# EAGLE design Front 2016 (EAGLE 6.5.0)
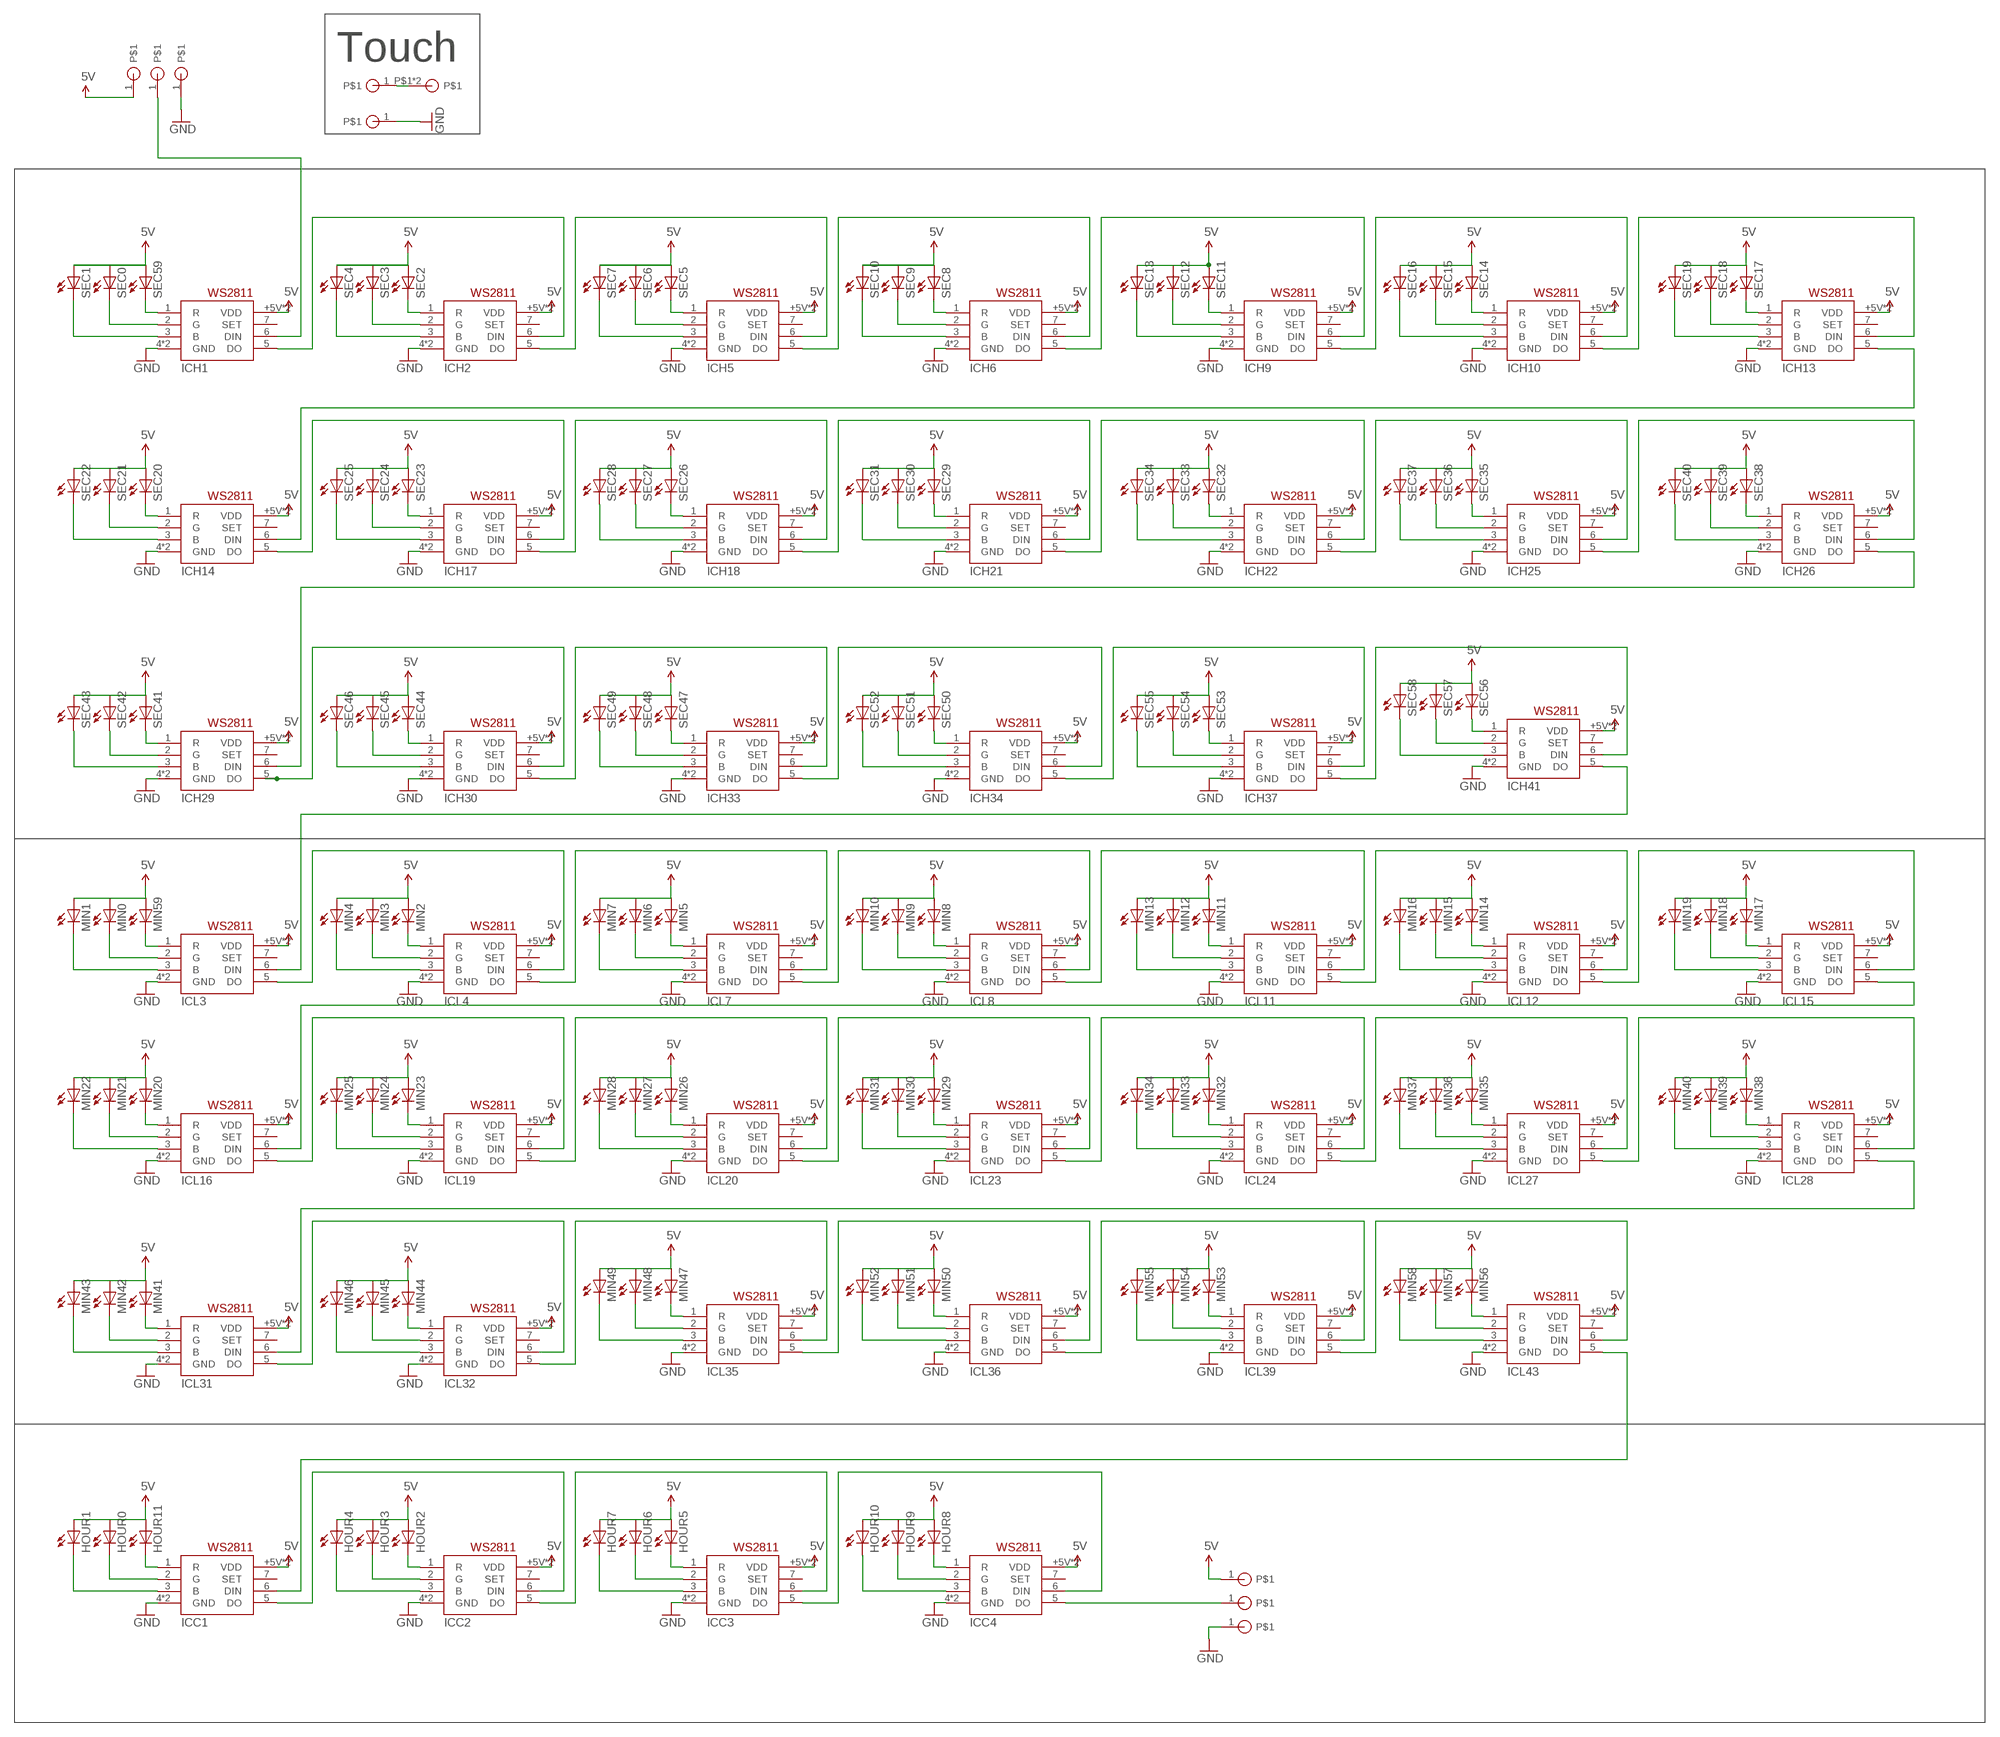
[diagram p0: schematic, sheet 1]

## Parts
+5V  SOLDER_PAD  [SOLDER_PAD]
+5V1  SOLDER_PAD  [SOLDER_PAD]
DIN  SOLDER_PAD  [SOLDER_PAD]
DOUT  SOLDER_PAD  [SOLDER_PAD]
GND  SOLDER_PAD  [SOLDER_PAD]
GND46  SOLDER_PAD  [SOLDER_PAD]
GND48  SOLDER_PAD  [SOLDER_PAD]
HOUR0  LEDCHIPLED_0603  [CHIPLED_0603]
HOUR1  LEDCHIPLED_0603  [CHIPLED_0603]
HOUR2  LEDCHIPLED_0603  [CHIPLED_0603]
HOUR3  LEDCHIPLED_0603  [CHIPLED_0603]
HOUR4  LEDCHIPLED_0603  [CHIPLED_0603]
HOUR5  LEDCHIPLED_0603  [CHIPLED_0603]
HOUR6  LEDCHIPLED_0603  [CHIPLED_0603]
HOUR7  LEDCHIPLED_0603  [CHIPLED_0603]
HOUR8  LEDCHIPLED_0603  [CHIPLED_0603]
HOUR9  LEDCHIPLED_0603  [CHIPLED_0603]
HOUR10  LEDCHIPLED_0603  [CHIPLED_0603]
HOUR11  LEDCHIPLED_0603  [CHIPLED_0603]
ICC1  WS2811-SOP8  [SO08-SKINNYPADS]
ICC2  WS2811-SOP8  [SO08-SKINNYPADS]
ICC3  WS2811-SOP8  [SO08-SKINNYPADS]
ICC4  WS2811-SOP8  [SO08-SKINNYPADS]
ICH1  WS2811-SOP8  [SO08-SKINNYPADS]
ICH2  WS2811-SOP8  [SO08-SKINNYPADS]
ICH5  WS2811-SOP8  [SO08-SKINNYPADS]
ICH6  WS2811-SOP8  [SO08-SKINNYPADS]
ICH9  WS2811-SOP8  [SO08-SKINNYPADS]
ICH10  WS2811-SOP8  [SO08-SKINNYPADS]
ICH13  WS2811-SOP8  [SO08-SKINNYPADS]
ICH14  WS2811-SOP8  [SO08-SKINNYPADS]
ICH17  WS2811-SOP8  [SO08-SKINNYPADS]
ICH18  WS2811-SOP8  [SO08-SKINNYPADS]
ICH21  WS2811-SOP8  [SO08-SKINNYPADS]
ICH22  WS2811-SOP8  [SO08-SKINNYPADS]
ICH25  WS2811-SOP8  [SO08-SKINNYPADS]
ICH26  WS2811-SOP8  [SO08-SKINNYPADS]
ICH29  WS2811-SOP8  [SO08-SKINNYPADS]
ICH30  WS2811-SOP8  [SO08-SKINNYPADS]
ICH33  WS2811-SOP8  [SO08-SKINNYPADS]
ICH34  WS2811-SOP8  [SO08-SKINNYPADS]
ICH37  WS2811-SOP8  [SO08-SKINNYPADS]
ICH41  WS2811-SOP8  [SO08-SKINNYPADS]
ICL3  WS2811-SOP8  [SO08-SKINNYPADS]
ICL4  WS2811-SOP8  [SO08-SKINNYPADS]
ICL7  WS2811-SOP8  [SO08-SKINNYPADS]
ICL8  WS2811-SOP8  [SO08-SKINNYPADS]
ICL11  WS2811-SOP8  [SO08-SKINNYPADS]
ICL12  WS2811-SOP8  [SO08-SKINNYPADS]
ICL15  WS2811-SOP8  [SO08-SKINNYPADS]
ICL16  WS2811-SOP8  [SO08-SKINNYPADS]
ICL19  WS2811-SOP8  [SO08-SKINNYPADS]
ICL20  WS2811-SOP8  [SO08-SKINNYPADS]
ICL23  WS2811-SOP8  [SO08-SKINNYPADS]
ICL24  WS2811-SOP8  [SO08-SKINNYPADS]
ICL27  WS2811-SOP8  [SO08-SKINNYPADS]
ICL28  WS2811-SOP8  [SO08-SKINNYPADS]
ICL31  WS2811-SOP8  [SO08-SKINNYPADS]
ICL32  WS2811-SOP8  [SO08-SKINNYPADS]
ICL35  WS2811-SOP8  [SO08-SKINNYPADS]
ICL36  WS2811-SOP8  [SO08-SKINNYPADS]
ICL39  WS2811-SOP8  [SO08-SKINNYPADS]
ICL43  WS2811-SOP8  [SO08-SKINNYPADS]
MIN0  LEDCHIPLED_0603  [CHIPLED_0603]
MIN1  LEDCHIPLED_0603  [CHIPLED_0603]
MIN2  LEDCHIPLED_0603  [CHIPLED_0603]
MIN3  LEDCHIPLED_0603  [CHIPLED_0603]
MIN4  LEDCHIPLED_0603  [CHIPLED_0603]
MIN5  LEDCHIPLED_0603  [CHIPLED_0603]
MIN6  LEDCHIPLED_0603  [CHIPLED_0603]
MIN7  LEDCHIPLED_0603  [CHIPLED_0603]
MIN8  LEDCHIPLED_0603  [CHIPLED_0603]
MIN9  LEDCHIPLED_0603  [CHIPLED_0603]
MIN10  LEDCHIPLED_0603  [CHIPLED_0603]
MIN11  LEDCHIPLED_0603  [CHIPLED_0603]
MIN12  LEDCHIPLED_0603  [CHIPLED_0603]
MIN13  LEDCHIPLED_0603  [CHIPLED_0603]
MIN14  LEDCHIPLED_0603  [CHIPLED_0603]
MIN15  LEDCHIPLED_0603  [CHIPLED_0603]
MIN16  LEDCHIPLED_0603  [CHIPLED_0603]
MIN17  LEDCHIPLED_0603  [CHIPLED_0603]
MIN18  LEDCHIPLED_0603  [CHIPLED_0603]
MIN19  LEDCHIPLED_0603  [CHIPLED_0603]
MIN20  LEDCHIPLED_0603  [CHIPLED_0603]
MIN21  LEDCHIPLED_0603  [CHIPLED_0603]
MIN22  LEDCHIPLED_0603  [CHIPLED_0603]
MIN23  LEDCHIPLED_0603  [CHIPLED_0603]
MIN24  LEDCHIPLED_0603  [CHIPLED_0603]
MIN25  LEDCHIPLED_0603  [CHIPLED_0603]
MIN26  LEDCHIPLED_0603  [CHIPLED_0603]
MIN27  LEDCHIPLED_0603  [CHIPLED_0603]
MIN28  LEDCHIPLED_0603  [CHIPLED_0603]
MIN29  LEDCHIPLED_0603  [CHIPLED_0603]
MIN30  LEDCHIPLED_0603  [CHIPLED_0603]
MIN31  LEDCHIPLED_0603  [CHIPLED_0603]
MIN32  LEDCHIPLED_0603  [CHIPLED_0603]
MIN33  LEDCHIPLED_0603  [CHIPLED_0603]
MIN34  LEDCHIPLED_0603  [CHIPLED_0603]
MIN35  LEDCHIPLED_0603  [CHIPLED_0603]
MIN36  LEDCHIPLED_0603  [CHIPLED_0603]
MIN37  LEDCHIPLED_0603  [CHIPLED_0603]
MIN38  LEDCHIPLED_0603  [CHIPLED_0603]
MIN39  LEDCHIPLED_0603  [CHIPLED_0603]
MIN40  LEDCHIPLED_0603  [CHIPLED_0603]
MIN41  LEDCHIPLED_0603  [CHIPLED_0603]
MIN42  LEDCHIPLED_0603  [CHIPLED_0603]
MIN43  LEDCHIPLED_0603  [CHIPLED_0603]
MIN44  LEDCHIPLED_0603  [CHIPLED_0603]
MIN45  LEDCHIPLED_0603  [CHIPLED_0603]
MIN46  LEDCHIPLED_0603  [CHIPLED_0603]
MIN47  LEDCHIPLED_0603  [CHIPLED_0603]
MIN48  LEDCHIPLED_0603  [CHIPLED_0603]
MIN49  LEDCHIPLED_0603  [CHIPLED_0603]
MIN50  LEDCHIPLED_0603  [CHIPLED_0603]
MIN51  LEDCHIPLED_0603  [CHIPLED_0603]
MIN52  LEDCHIPLED_0603  [CHIPLED_0603]
MIN53  LEDCHIPLED_0603  [CHIPLED_0603]
MIN54  LEDCHIPLED_0603  [CHIPLED_0603]
MIN55  LEDCHIPLED_0603  [CHIPLED_0603]
MIN56  LEDCHIPLED_0603  [CHIPLED_0603]
MIN57  LEDCHIPLED_0603  [CHIPLED_0603]
MIN58  LEDCHIPLED_0603  [CHIPLED_0603]
MIN59  LEDCHIPLED_0603  [CHIPLED_0603]
SEC0  LEDCHIPLED_0603  [CHIPLED_0603]
SEC1  LEDCHIPLED_0603  [CHIPLED_0603]
SEC2  LEDCHIPLED_0603  [CHIPLED_0603]
SEC3  LEDCHIPLED_0603  [CHIPLED_0603]
SEC4  LEDCHIPLED_0603  [CHIPLED_0603]
SEC5  LEDCHIPLED_0603  [CHIPLED_0603]
SEC6  LEDCHIPLED_0603  [CHIPLED_0603]
SEC7  LEDCHIPLED_0603  [CHIPLED_0603]
SEC8  LEDCHIPLED_0603  [CHIPLED_0603]
SEC9  LEDCHIPLED_0603  [CHIPLED_0603]
SEC10  LEDCHIPLED_0603  [CHIPLED_0603]
SEC11  LEDCHIPLED_0603  [CHIPLED_0603]
SEC12  LEDCHIPLED_0603  [CHIPLED_0603]
SEC13  LEDCHIPLED_0603  [CHIPLED_0603]
SEC14  LEDCHIPLED_0603  [CHIPLED_0603]
SEC15  LEDCHIPLED_0603  [CHIPLED_0603]
SEC16  LEDCHIPLED_0603  [CHIPLED_0603]
SEC17  LEDCHIPLED_0603  [CHIPLED_0603]
SEC18  LEDCHIPLED_0603  [CHIPLED_0603]
SEC19  LEDCHIPLED_0603  [CHIPLED_0603]
SEC20  LEDCHIPLED_0603  [CHIPLED_0603]
SEC21  LEDCHIPLED_0603  [CHIPLED_0603]
SEC22  LEDCHIPLED_0603  [CHIPLED_0603]
SEC23  LEDCHIPLED_0603  [CHIPLED_0603]
SEC24  LEDCHIPLED_0603  [CHIPLED_0603]
SEC25  LEDCHIPLED_0603  [CHIPLED_0603]
SEC26  LEDCHIPLED_0603  [CHIPLED_0603]
SEC27  LEDCHIPLED_0603  [CHIPLED_0603]
SEC28  LEDCHIPLED_0603  [CHIPLED_0603]
SEC29  LEDCHIPLED_0603  [CHIPLED_0603]
SEC30  LEDCHIPLED_0603  [CHIPLED_0603]
SEC31  LEDCHIPLED_0603  [CHIPLED_0603]
SEC32  LEDCHIPLED_0603  [CHIPLED_0603]
SEC33  LEDCHIPLED_0603  [CHIPLED_0603]
SEC34  LEDCHIPLED_0603  [CHIPLED_0603]
SEC35  LEDCHIPLED_0603  [CHIPLED_0603]
SEC36  LEDCHIPLED_0603  [CHIPLED_0603]
SEC37  LEDCHIPLED_0603  [CHIPLED_0603]
SEC38  LEDCHIPLED_0603  [CHIPLED_0603]
SEC39  LEDCHIPLED_0603  [CHIPLED_0603]
SEC40  LEDCHIPLED_0603  [CHIPLED_0603]
SEC41  LEDCHIPLED_0603  [CHIPLED_0603]
SEC42  LEDCHIPLED_0603  [CHIPLED_0603]
SEC43  LEDCHIPLED_0603  [CHIPLED_0603]
SEC44  LEDCHIPLED_0603  [CHIPLED_0603]
SEC45  LEDCHIPLED_0603  [CHIPLED_0603]
SEC46  LEDCHIPLED_0603  [CHIPLED_0603]
SEC47  LEDCHIPLED_0603  [CHIPLED_0603]
SEC48  LEDCHIPLED_0603  [CHIPLED_0603]
SEC49  LEDCHIPLED_0603  [CHIPLED_0603]
SEC50  LEDCHIPLED_0603  [CHIPLED_0603]
SEC51  LEDCHIPLED_0603  [CHIPLED_0603]
SEC52  LEDCHIPLED_0603  [CHIPLED_0603]
SEC53  LEDCHIPLED_0603  [CHIPLED_0603]
SEC54  LEDCHIPLED_0603  [CHIPLED_0603]
SEC55  LEDCHIPLED_0603  [CHIPLED_0603]
SEC56  LEDCHIPLED_0603  [CHIPLED_0603]
SEC57  LEDCHIPLED_0603  [CHIPLED_0603]
SEC58  LEDCHIPLED_0603  [CHIPLED_0603]
SEC59  LEDCHIPLED_0603  [CHIPLED_0603]
TOUCH  SOLDER_PAD  [SOLDER_PAD]
U$2  TOUCH_PAD_LARGE  [TOUCH_PAD_LARGE]

## Nets
5V: +5V1.1 +5V.1 HOUR0.A HOUR1.A HOUR2.A HOUR3.A HOUR4.A HOUR5.A HOUR6.A HOUR7.A HOUR8.A HOUR9.A HOUR10.A HOUR11.A ICC1.8(VDD) ICC1.+5V(VDD) ICC2.8(VDD) ICC2.+5V(VDD) ICC3.8(VDD) ICC3.+5V(VDD) ICC4.8(VDD) ICC4.+5V(VDD) ICH1.8(VDD) ICH1.+5V(VDD) ICH2.8(VDD) ICH2.+5V(VDD) ICH5.8(VDD) ICH5.+5V(VDD) ICH6.8(VDD) ICH6.+5V(VDD) ICH9.8(VDD) ICH9.+5V(VDD) ICH10.8(VDD) ICH10.+5V(VDD) ICH13.8(VDD) ICH13.+5V(VDD) ICH14.8(VDD) ICH14.+5V(VDD) ICH17.8(VDD) ICH17.+5V(VDD) ICH18.8(VDD) ICH18.+5V(VDD) ICH21.8(VDD) ICH21.+5V(VDD) ICH22.8(VDD) ICH22.+5V(VDD) ICH25.8(VDD) ICH25.+5V(VDD) ICH26.8(VDD) ICH26.+5V(VDD) ICH29.8(VDD) ICH29.+5V(VDD) ICH30.8(VDD) ICH30.+5V(VDD) ICH33.8(VDD) ICH33.+5V(VDD) ICH34.8(VDD) ICH34.+5V(VDD) ICH37.8(VDD) ICH37.+5V(VDD) ICH41.8(VDD) ICH41.+5V(VDD) ICL3.8(VDD) ICL3.+5V(VDD) ICL4.8(VDD) ICL4.+5V(VDD) ICL7.8(VDD) ICL7.+5V(VDD) ICL8.8(VDD) ICL8.+5V(VDD) ICL11.8(VDD) ICL11.+5V(VDD) ICL12.8(VDD) ICL12.+5V(VDD) ICL15.8(VDD) ICL15.+5V(VDD) ICL16.8(VDD) ICL16.+5V(VDD) ICL19.8(VDD) ICL19.+5V(VDD) ICL20.8(VDD) ICL20.+5V(VDD) ICL23.8(VDD) ICL23.+5V(VDD) ICL24.8(VDD) ICL24.+5V(VDD) ICL27.8(VDD) ICL27.+5V(VDD) ICL28.8(VDD) ICL28.+5V(VDD) ICL31.8(VDD) ICL31.+5V(VDD) ICL32.8(VDD) ICL32.+5V(VDD) ICL35.8(VDD) ICL35.+5V(VDD) ICL36.8(VDD) ICL36.+5V(VDD) ICL39.8(VDD) ICL39.+5V(VDD) ICL43.8(VDD) ICL43.+5V(VDD) MIN0.A MIN1.A MIN2.A MIN3.A MIN4.A MIN5.A MIN6.A MIN7.A MIN8.A MIN9.A MIN10.A MIN11.A MIN12.A MIN13.A MIN14.A MIN15.A MIN16.A MIN17.A MIN18.A MIN19.A MIN20.A MIN21.A MIN22.A MIN23.A MIN24.A MIN25.A MIN26.A MIN27.A MIN28.A MIN29.A MIN30.A MIN31.A MIN32.A MIN33.A MIN34.A MIN35.A MIN36.A MIN37.A MIN38.A MIN39.A MIN40.A MIN41.A MIN42.A MIN43.A MIN44.A MIN45.A MIN46.A MIN47.A MIN48.A MIN49.A MIN50.A MIN51.A MIN52.A MIN53.A MIN54.A MIN55.A MIN56.A MIN57.A MIN58.A MIN59.A SEC0.A SEC1.A SEC2.A SEC3.A SEC4.A SEC5.A SEC6.A SEC7.A SEC8.A SEC9.A SEC10.A SEC11.A SEC12.A SEC13.A SEC14.A SEC15.A SEC16.A SEC17.A SEC18.A SEC19.A SEC20.A SEC21.A SEC22.A SEC23.A SEC24.A SEC25.A SEC26.A SEC27.A SEC28.A SEC29.A SEC30.A SEC31.A SEC32.A SEC33.A SEC34.A SEC35.A SEC36.A SEC37.A SEC38.A SEC39.A SEC40.A SEC41.A SEC42.A SEC43.A SEC44.A SEC45.A SEC46.A SEC47.A SEC48.A SEC49.A SEC50.A SEC51.A SEC52.A SEC53.A SEC54.A SEC55.A SEC56.A SEC57.A SEC58.A SEC59.A
GND: GND46.1 GND48.1 GND.1 ICC1.4(GND) ICC1.GND ICC2.4(GND) ICC2.GND ICC3.4(GND) ICC3.GND ICC4.4(GND) ICC4.GND ICH1.4(GND) ICH1.GND ICH2.4(GND) ICH2.GND ICH5.4(GND) ICH5.GND ICH6.4(GND) ICH6.GND ICH9.4(GND) ICH9.GND ICH10.4(GND) ICH10.GND ICH13.4(GND) ICH13.GND ICH14.4(GND) ICH14.GND ICH17.4(GND) ICH17.GND ICH18.4(GND) ICH18.GND ICH21.4(GND) ICH21.GND ICH22.4(GND) ICH22.GND ICH25.4(GND) ICH25.GND ICH26.4(GND) ICH26.GND ICH29.4(GND) ICH29.GND ICH30.4(GND) ICH30.GND ICH33.4(GND) ICH33.GND ICH34.4(GND) ICH34.GND ICH37.4(GND) ICH37.GND ICH41.4(GND) ICH41.GND ICL3.4(GND) ICL3.GND ICL4.4(GND) ICL4.GND ICL7.4(GND) ICL7.GND ICL8.4(GND) ICL8.GND ICL11.4(GND) ICL11.GND ICL12.4(GND) ICL12.GND ICL15.4(GND) ICL15.GND ICL16.4(GND) ICL16.GND ICL19.4(GND) ICL19.GND ICL20.4(GND) ICL20.GND ICL23.4(GND) ICL23.GND ICL24.4(GND) ICL24.GND ICL27.4(GND) ICL27.GND ICL28.4(GND) ICL28.GND ICL31.4(GND) ICL31.GND ICL32.4(GND) ICL32.GND ICL35.4(GND) ICL35.GND ICL36.4(GND) ICL36.GND ICL39.4(GND) ICL39.GND ICL43.4(GND) ICL43.GND
N$1: ICH1.1(R) SEC59.C
N$2: ICH1.3(B) SEC1.C
N$3: ICH1.2(G) SEC0.C
N$4: ICH2.1(R) SEC2.C
N$5: ICH2.2(G) SEC3.C
N$6: ICH2.3(B) SEC4.C
N$7: ICH5.1(R) SEC5.C
N$8: ICH5.2(G) SEC6.C
N$9: ICH5.3(B) SEC7.C
N$10: ICH6.1(R) SEC8.C
N$11: ICH6.2(G) SEC9.C
N$12: ICH6.3(B) SEC10.C
N$13: ICH13.1(R) SEC17.C
N$14: ICH9.1(R) SEC11.C
N$15: ICH9.2(G) SEC12.C
N$16: ICH9.3(B) SEC13.C
N$17: ICH26.2(G) SEC39.C
N$18: ICH10.1(R) SEC14.C
N$19: ICH10.2(G) SEC15.C
N$20: ICH10.3(B) SEC16.C
N$21: ICH14.1(R) SEC20.C
N$22: ICH13.2(G) SEC18.C
N$23: ICH13.3(B) SEC19.C
N$24: ICH14.2(G) SEC21.C
N$25: ICH14.3(B) SEC22.C
N$26: ICH26.3(B) SEC40.C
N$27: ICH17.1(R) SEC23.C
N$28: ICH17.2(G) SEC24.C
N$29: ICH17.3(B) SEC25.C
N$30: ICH18.1(R) SEC26.C
N$31: ICH18.2(G) SEC27.C
N$32: ICH18.3(B) SEC28.C
N$33: ICH29.5(DO) ICH30.6(DIN)
N$34: ICH29.1(R) SEC41.C
N$35: ICH21.1(R) SEC29.C
N$36: ICH21.2(G) SEC30.C
N$37: ICH21.3(B) SEC31.C
N$38: ICH29.2(G) SEC42.C
N$39: ICH22.1(R) SEC32.C
N$40: ICH22.2(G) SEC33.C
N$41: ICH22.3(B) SEC34.C
N$42: ICH29.3(B) SEC43.C
N$43: ICH25.1(R) SEC35.C
N$44: ICH25.2(G) SEC36.C
N$45: ICH25.3(B) SEC37.C
N$46: ICH30.5(DO) ICH33.6(DIN)
N$47: ICH26.1(R) SEC38.C
N$48: ICH30.1(R) SEC44.C
N$49: ICH30.2(G) SEC45.C
N$50: ICH30.3(B) SEC46.C
N$51: ICH33.5(DO) ICH34.6(DIN)
N$52: ICH33.1(R) SEC47.C
N$53: ICH33.2(G) SEC48.C
N$54: ICH33.3(B) SEC49.C
N$55: ICH34.5(DO) ICH37.6(DIN)
N$56: ICH34.1(R) SEC50.C
N$57: ICH34.2(G) SEC51.C
N$58: ICH34.3(B) SEC52.C
N$59: ICH37.5(DO) ICH41.6(DIN)
N$60: ICH37.1(R) SEC53.C
N$61: ICH37.2(G) SEC54.C
N$62: ICH37.3(B) SEC55.C
N$63: ICH41.5(DO) ICL3.6(DIN)
N$64: ICH41.1(R) SEC56.C
N$65: ICH41.2(G) SEC57.C
N$66: ICH41.3(B) SEC58.C
N$67: ICH1.5(DO) ICH2.6(DIN)
N$68: ICH2.5(DO) ICH5.6(DIN)
N$69: ICH5.5(DO) ICH6.6(DIN)
N$70: ICH6.5(DO) ICH9.6(DIN)
N$71: ICH9.5(DO) ICH10.6(DIN)
N$72: ICH10.5(DO) ICH13.6(DIN)
N$73: ICH13.5(DO) ICH14.6(DIN)
N$74: ICH14.5(DO) ICH17.6(DIN)
N$75: ICH17.5(DO) ICH18.6(DIN)
N$76: ICH18.5(DO) ICH21.6(DIN)
N$77: ICH21.5(DO) ICH22.6(DIN)
N$78: ICH22.5(DO) ICH25.6(DIN)
N$79: ICH25.5(DO) ICH26.6(DIN)
N$80: ICH26.5(DO) ICH29.6(DIN)
N$81: ICL3.1(R) MIN59.C
N$82: ICL3.2(G) MIN0.C
N$83: ICL3.3(B) MIN1.C
N$84: ICL4.1(R) MIN2.C
N$85: ICL4.2(G) MIN3.C
N$86: ICL4.3(B) MIN4.C
N$87: ICL7.1(R) MIN5.C
N$88: ICL7.2(G) MIN6.C
N$89: ICL7.3(B) MIN7.C
N$90: ICL8.1(R) MIN8.C
N$91: ICL8.2(G) MIN9.C
N$92: ICL8.3(B) MIN10.C
N$93: ICL3.5(DO) ICL4.6(DIN)
N$94: ICL4.5(DO) ICL7.6(DIN)
N$95: ICL11.1(R) MIN11.C
N$96: ICL11.2(G) MIN12.C
N$97: ICL11.3(B) MIN13.C
N$98: ICL7.5(DO) ICL8.6(DIN)
N$99: ICL12.1(R) MIN14.C
N$100: ICL12.2(G) MIN15.C
N$101: ICL12.3(B) MIN16.C
N$102: ICL8.5(DO) ICL11.6(DIN)
N$103: ICL15.1(R) MIN17.C
N$104: ICL15.2(G) MIN18.C
N$105: ICL15.3(B) MIN19.C
N$106: ICL11.5(DO) ICL12.6(DIN)
N$107: ICL16.1(R) MIN20.C
N$108: ICL16.2(G) MIN21.C
N$109: ICL16.3(B) MIN22.C
N$110: ICL12.5(DO) ICL15.6(DIN)
N$111: ICL19.1(R) MIN23.C
N$112: ICL19.2(G) MIN24.C
N$113: ICL19.3(B) MIN25.C
N$114: ICL15.5(DO) ICL16.6(DIN)
N$115: ICL20.1(R) MIN26.C
N$116: ICL20.2(G) MIN27.C
N$117: ICL20.3(B) MIN28.C
N$118: ICL16.5(DO) ICL19.6(DIN)
N$119: ICL23.1(R) MIN29.C
N$120: ICL23.2(G) MIN30.C
N$121: ICL23.3(B) MIN31.C
N$122: ICL19.5(DO) ICL20.6(DIN)
N$123: ICL24.1(R) MIN32.C
N$124: ICL24.2(G) MIN33.C
N$125: ICL24.3(B) MIN34.C
N$126: ICL20.5(DO) ICL23.6(DIN)
N$127: ICL27.1(R) MIN35.C
N$128: ICL27.2(G) MIN36.C
N$129: ICL27.3(B) MIN37.C
N$130: ICL23.5(DO) ICL24.6(DIN)
N$131: ICL28.1(R) MIN38.C
N$132: ICL28.2(G) MIN39.C
N$133: ICL28.3(B) MIN40.C
N$134: ICL24.5(DO) ICL27.6(DIN)
N$135: ICL31.1(R) MIN41.C
N$136: ICL31.2(G) MIN42.C
N$137: ICL31.3(B) MIN43.C
N$138: ICL27.5(DO) ICL28.6(DIN)
N$139: ICL32.1(R) MIN44.C
N$140: ICL32.2(G) MIN45.C
N$141: ICL32.3(B) MIN46.C
N$142: ICL28.5(DO) ICL31.6(DIN)
N$143: ICL35.1(R) MIN47.C
N$144: ICL35.2(G) MIN48.C
N$145: ICL35.3(B) MIN49.C
N$146: ICL31.5(DO) ICL32.6(DIN)
N$147: ICL36.1(R) MIN50.C
N$148: ICL36.2(G) MIN51.C
N$149: ICL36.3(B) MIN52.C
N$150: ICL32.5(DO) ICL35.6(DIN)
N$151: ICL39.1(R) MIN53.C
N$152: ICL39.2(G) MIN54.C
N$153: ICL39.3(B) MIN55.C
N$154: ICL35.5(DO) ICL36.6(DIN)
N$155: ICL43.1(R) MIN56.C
N$156: ICL43.2(G) MIN57.C
N$157: ICL43.3(B) MIN58.C
N$158: ICL36.5(DO) ICL39.6(DIN)
N$159: ICL39.5(DO) ICL43.6(DIN)
N$160: DIN.1 ICH1.6(DIN)
N$161: HOUR11.C ICC1.1(R)
N$162: HOUR0.C ICC1.2(G)
N$163: HOUR1.C ICC1.3(B)
N$164: DOUT.1 ICC4.5(DO)
N$165: HOUR2.C ICC2.1(R)
N$166: HOUR3.C ICC2.2(G)
N$167: HOUR4.C ICC2.3(B)
N$169: HOUR5.C ICC3.1(R)
N$170: HOUR6.C ICC3.2(G)
N$171: HOUR7.C ICC3.3(B)
N$173: HOUR8.C ICC4.1(R)
N$174: HOUR9.C ICC4.2(G)
N$175: HOUR10.C ICC4.3(B)
N$176: ICC1.6(DIN) ICL43.5(DO)
N$177: ICC1.5(DO) ICC2.6(DIN)
N$178: ICC2.5(DO) ICC3.6(DIN)
N$179: ICC3.5(DO) ICC4.6(DIN)
TOUCH: TOUCH.1 U$2.P$1 U$2.P$2
Unconnected: ICC1.7(SET) ICC2.7(SET) ICC3.7(SET) ICC4.7(SET) ICH1.7(SET) ICH2.7(SET) ICH5.7(SET) ICH6.7(SET) ICH9.7(SET) ICH10.7(SET) ICH13.7(SET) ICH14.7(SET) ICH17.7(SET) ICH18.7(SET) ICH21.7(SET) ICH22.7(SET) ICH25.7(SET) ICH26.7(SET) ICH29.7(SET) ICH30.7(SET) ICH33.7(SET) ICH34.7(SET) ICH37.7(SET) ICH41.7(SET) ICL3.7(SET) ICL4.7(SET) ICL7.7(SET) ICL8.7(SET) ICL11.7(SET) ICL12.7(SET) ICL15.7(SET) ICL16.7(SET) ICL19.7(SET) ICL20.7(SET) ICL23.7(SET) ICL24.7(SET) ICL27.7(SET) ICL28.7(SET) ICL31.7(SET) ICL32.7(SET) ICL35.7(SET) ICL36.7(SET) ICL39.7(SET) ICL43.7(SET)

## Notes on the sheet
- Touch

## Library data of the parts
+5V +5V1 DIN DOUT GND GND46 GND48 TOUCH = timearc:SOLDER_PAD
HOUR0 HOUR1-HOUR11 MIN0 MIN1-MIN59 SEC0 SEC1-SEC59 = timearc:LED: LED OSRAM: - CHIPLED LG R971, LG N971, LY N971, LG Q971, LY Q971, LO R971, LY R971 LH N974, LH R974 LS Q976, LO Q976, LY Q976 LO Q996 - Hyper CHIPLED LW Q18S LB Q993, LB Q99A, LB R99A - SideLED LS A670, LO A670, LY A670, LG A670, LP A670 LB A673, LV A673, LT A673, LW A673 LH A674 LY A675 LS A676, LA A676, LO A676, LY A676, LW A676 LS A679, LY A679, LG A679 - Hyper Micro SIDELED® LS Y876, LA Y876, LO Y876, LY Y876 LT Y87S - SmartLED LW L88C, LW L88S LB L89C, LB L89S, LG L890 LS L89K, LO L89K, LY L89K LS L896, LA L896, LO L896, LY L896 - TOPLED LS T670, LO T670, LY T670, LG T670, LP T670 LSG T670, LSP T670, LSY T670, LOP T670, LYG T670 LG T671, LOG T671, LSG T671 LB T673, LV T673, LT T673, LW T673 LH T674 LS T676, LA T676, LO T676, LY T676, LB T676, LH T676, LSB T676, LW T676 LB T67C, LV T67C, LT T67C, LS T67K, LO T67K, LY T67K, LW E67C LS E67B, LA E67B, LO E67B, LY E67B, LB E67C, LV E67C, LT E67C LW T67C LS T679, LY T679, LG T679 LS T770, LO T770, LY T770, LG T770, LP T770 LB T773, LV T773, LT T773, LW T773 LH T774 LS E675, LA E675, LY E675, LS T675 LS T776, LA T776, LO T776, LY T776, LB T776 LHGB T686 LT T68C, LB T68C - Hyper Mini TOPLED® LB M676 - Mini TOPLED Santana® LG M470 LS M47K, LO M47K, LY M47K Source: http://www.osram.convergy.de LUXEON: - LUMILED® LXK2-PW12-R00, LXK2-PW12-S00, LXK2-PW14-U00, LXK2-PW14-V00 LXK2-PM12-R00, LXK2-PM12-S00, LXK2-PM14-U00 LXK2-PE12-Q00, LXK2-PE12-R00, LXK2-PE12-S00, LXK2-PE14-T00, LXK2-PE14-U00 LXK2-PB12-K00, LXK2-PB12-L00, LXK2-PB12-M00, LXK2-PB14-N00, LXK2-PB14-P00, LXK2-PB14-Q00 LXK2-PR12-L00, LXK2-PR12-M00, LXK2-PR14-Q00, LXK2-PR14-R00 LXK2-PD12-Q00, LXK2-PD12-R00, LXK2-PD12-S00 LXK2-PH12-R00, LXK2-PH12-S00 LXK2-PL12-P00, LXK2-PL12-Q00, LXK2-PL12-R00 Source: www.luxeon.com KINGBRIGHT: KA-3528ASYC Source: www.kingbright.com
ICC1-ICC4 ICH1 ICH2 ICH5 ICH6 ICH9 ICH10 ICH13 ICH14 ICH17 ICH18 ICH21 ICH22 ICH25 ICH26 ICH29 ICH30 ICH33 ICH34 ICH37 ICH41 ICL3 ICL4 ICL7 ICL8 ICL11 ICL12 ICL15 ICL16 ICL19 ICL20 ICL23 ICL24 ICL27 ICL28 ICL31 ICL32 ICL35 ICL36 ICL39 ICL43 = timearc:WS2811
U$2 = timearc:TOUCH_PAD_LARGE

## Board
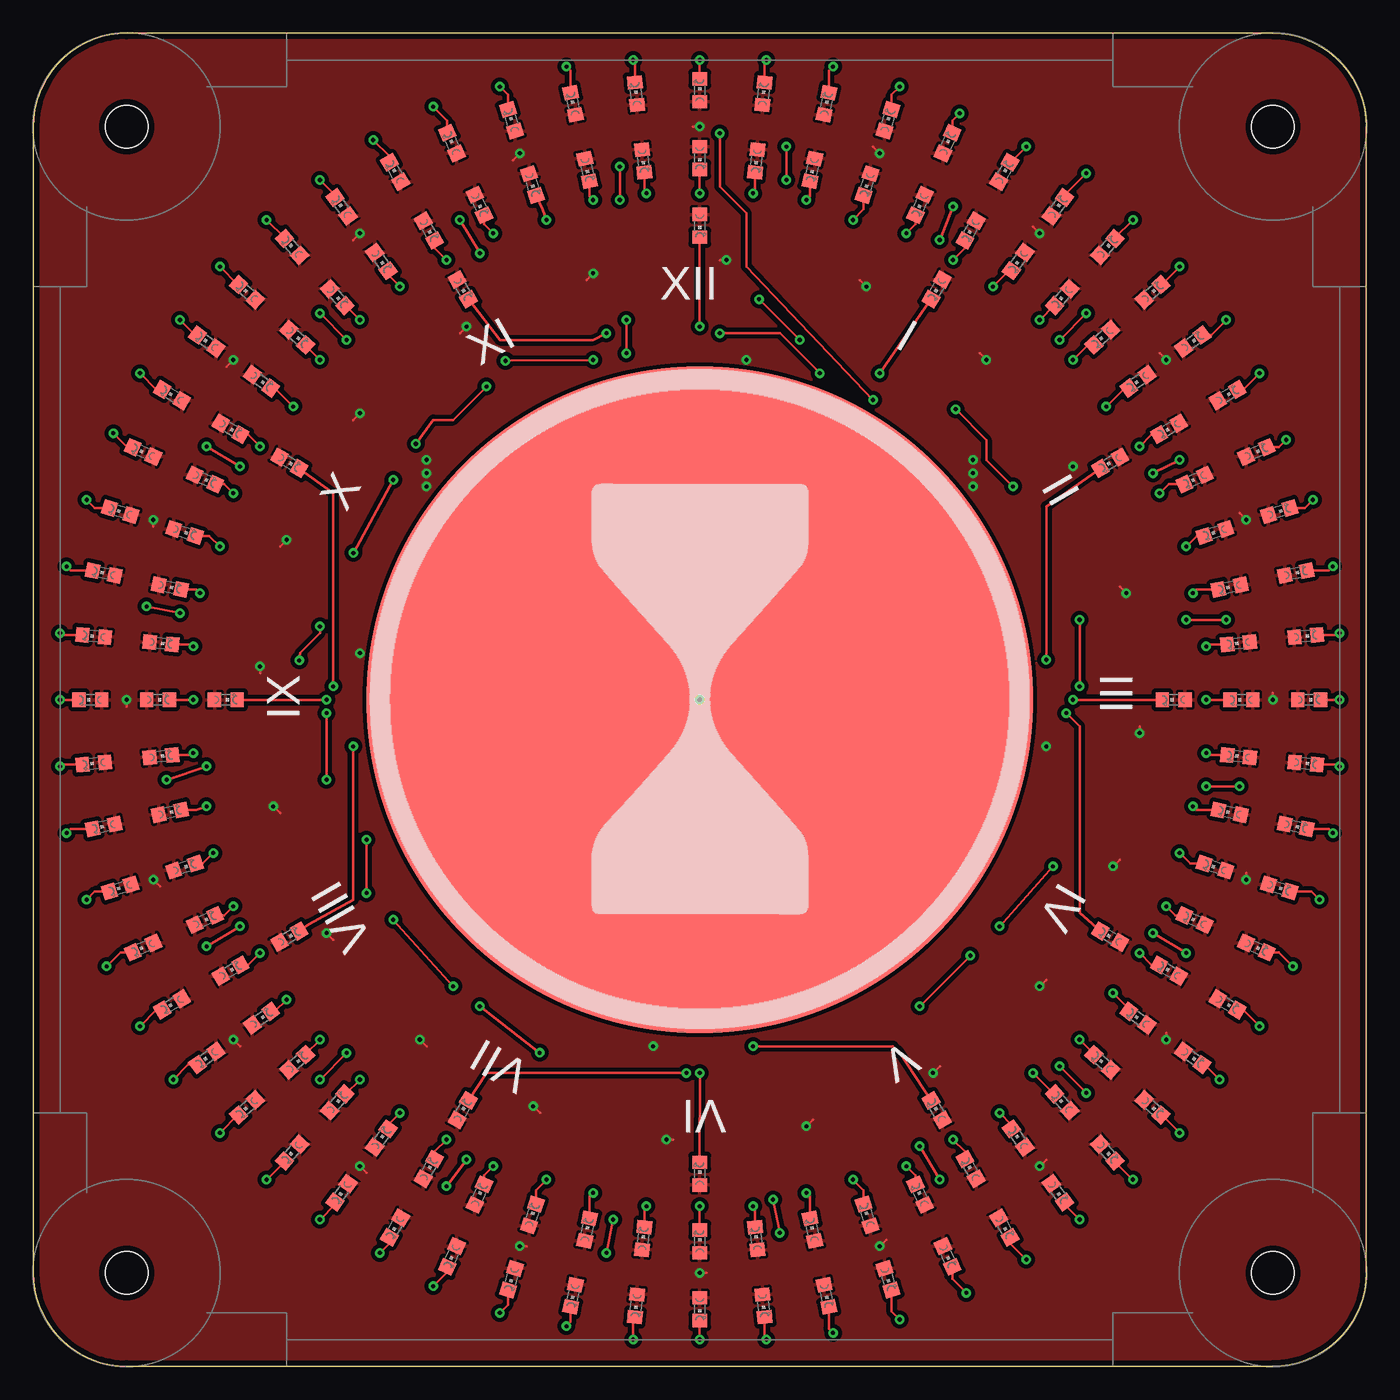
[diagram p1: board, top side]
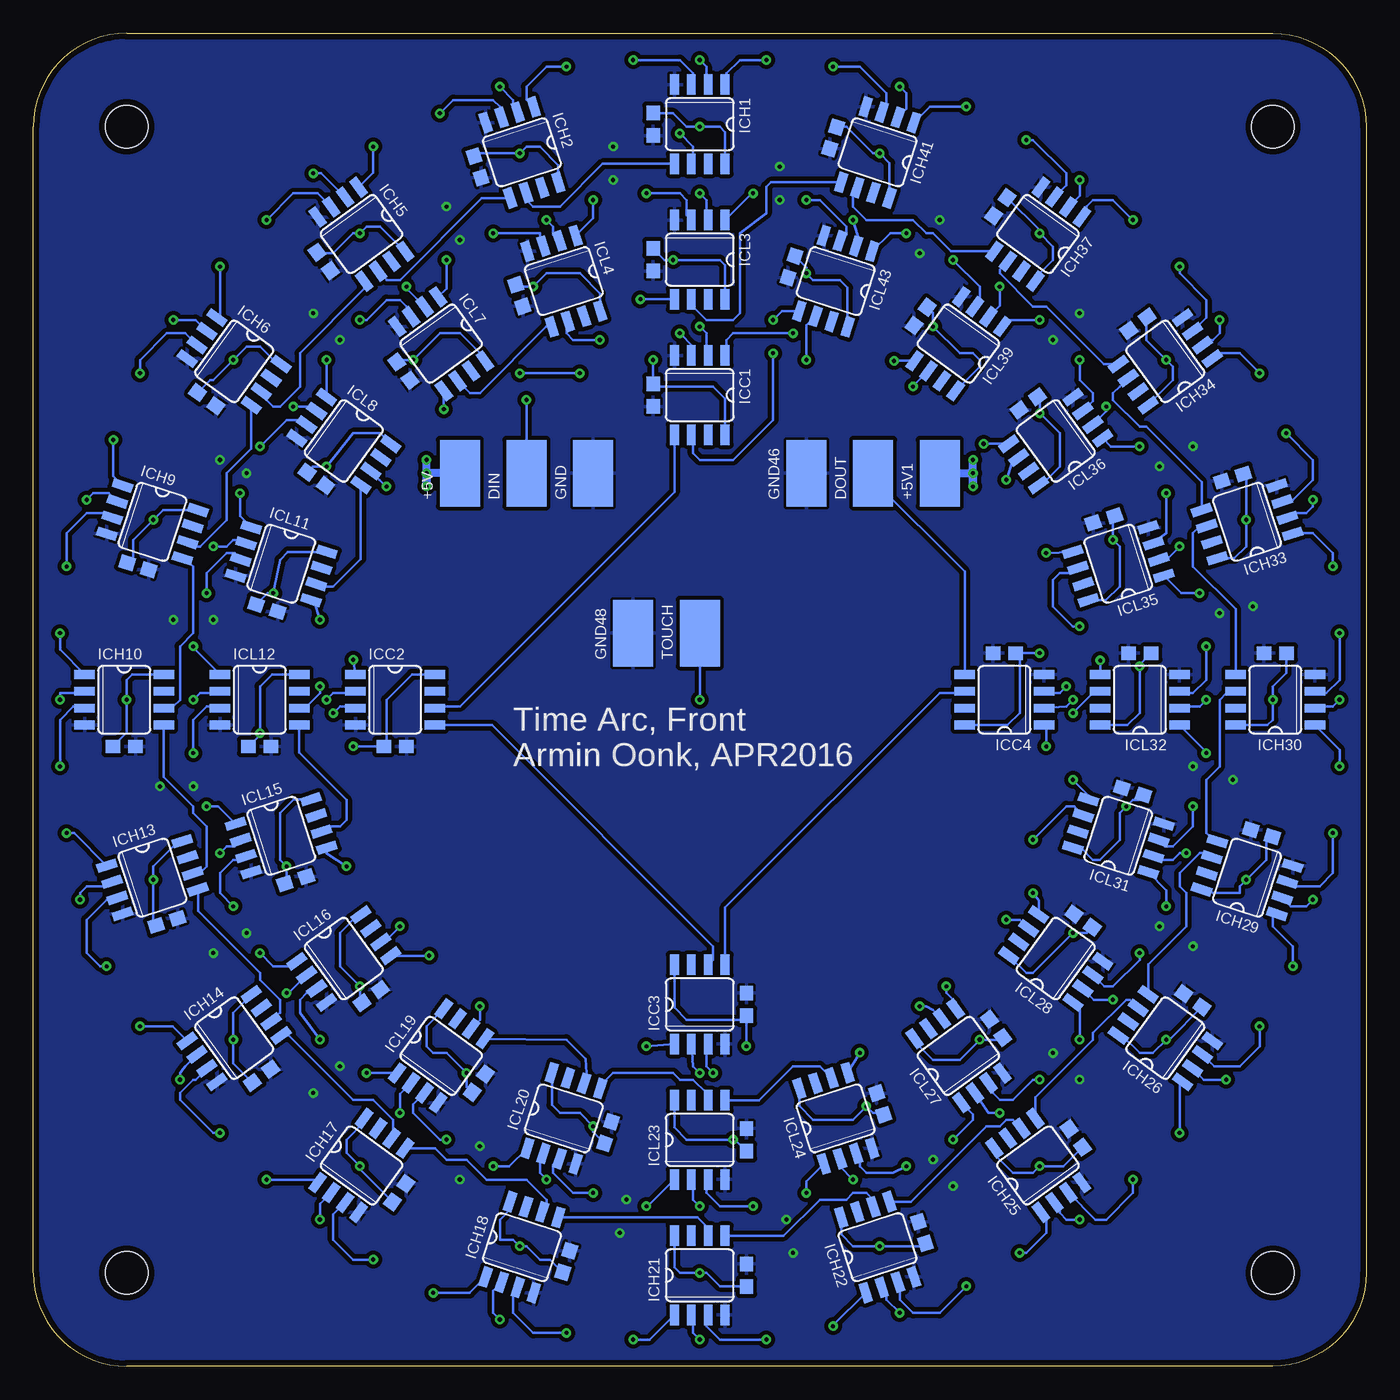
[diagram p2: board, bottom side, seen from below]

Size 100 x 100 mm. Coordinates in mm from the lower left corner, seen from the top.
Outline: 7,0 93,0 arc90 100,7 100,93 arc90 93,100 7,100 arc90 0,93 0,7 arc90 7,0
Copper layers (1*16): Top 0.018mm / dielectric 1.55mm / Bottom 0.018mm
Design rules "eC-PCB_proto-2-layer *": minimum track width 0.15mm, minimum drill 0.25mm, track to track 0.15mm, track to pad 0.15mm, pad to pad 0.15mm, via to via 0.15mm, smd to smd 0.15mm, copper to edge 0.45mm, drill to drill 0.3mm, minimum pad ring 0.2mm, minimum via ring 0.2mm, stop-mask expansion 0.1mm, vias tented up to drill 0.35mm, thermal gap 0.2mm

### Footprints (pad centres in the part's own frame; a part is rotated, then mirrored left to right if it is on the bottom)
SOLDER_PAD = smd 3 x 5: 1 0,0
CHIPLED_0603 = smd 1.1 x 1: A 0,-0.85; C 0,0.85
SO08-SKINNYPADS = smd 0.66 x 1.524: 1 -1.905,-2.973; 2 -0.635,-2.973; 3 0.635,-2.973; 4 1.905,-2.973; 5 1.905,2.973; 6 0.635,2.973; 7 -0.635,2.973; 8 -1.905,2.973 | smd 1 x 1.1: +5V 3.5,-0.85; GND 3.5,0.85
TIMEARC_KEEPOUT = hole 3.2: 7,93; 93,93; 93,7; 7,7
TOUCH_PAD_LARGE = smd 50 x 50: P$1 0,0 | drill 0.31: P$2 0,0

### Placement (x,y rotation side)
+5V  68,67 0 bottom
+5V1  32,67 0 bottom
DIN  63,67 0 bottom
DOUT  37,67 0 bottom
GND  58,67 0 bottom
GND46  42,67 0 bottom
GND48  55,55 0 bottom
HOUR0  50,85.56 180 top
HOUR1  67.78,80.8 150 top
HOUR2  80.8,67.78 120 top
HOUR3  85.56,50 90 top
HOUR4  80.8,32.22 60 top
HOUR5  67.78,19.2 30 top
HOUR6  50,14.44 0 top
HOUR7  32.22,19.2 330 top
HOUR8  19.2,32.22 300 top
HOUR9  14.44,50 270 top
HOUR10  19.2,67.78 240 top
HOUR11  32.22,80.8 210 top
ICC1  50,72.86 180 bottom
ICC2  72.86,50 270 bottom
ICC3  50,27.14 0 bottom
ICC4  27.14,50 90 bottom
ICH1  50,93.18 180 bottom
ICH2  63.34,91.07 198 bottom
ICH5  75.38,84.93 216 bottom
ICH6  84.93,75.38 234 bottom
ICH9  91.07,63.34 252 bottom
ICH10  93.18,50 270 bottom
ICH13  91.07,36.66 288 bottom
ICH14  84.93,24.62 306 bottom
ICH17  75.38,15.07 324 bottom
ICH18  63.34,8.93 342 bottom
ICH21  50,6.82 0 bottom
ICH22  36.66,8.93 18 bottom
ICH25  24.62,15.07 36 bottom
ICH26  15.07,24.62 54 bottom
ICH29  8.93,36.66 72 bottom
ICH30  6.82,50 90 bottom
ICH33  8.93,63.34 108 bottom
ICH34  15.07,75.38 126 bottom
ICH37  24.62,84.93 144 bottom
ICH41  36.66,91.07 162 bottom
ICL3  50,83.02 180 bottom
ICL4  60.2,81.4 198 bottom
ICL7  69.41,76.71 216 bottom
ICL8  76.71,69.41 234 bottom
ICL11  81.4,60.2 252 bottom
ICL12  83.02,50 270 bottom
ICL15  81.4,39.8 288 bottom
ICL16  76.71,30.59 306 bottom
ICL19  69.41,23.29 324 bottom
ICL20  60.2,18.6 342 bottom
ICL23  50,16.98 0 bottom
ICL24  39.8,18.6 18 bottom
ICL27  30.59,23.29 36 bottom
ICL28  23.29,30.59 54 bottom
ICL31  18.6,39.8 72 bottom
ICL32  16.98,50 90 bottom
ICL35  18.6,60.2 108 bottom
ICL36  23.29,69.41 126 bottom
ICL39  30.59,76.71 144 bottom
ICL43  39.8,81.4 162 bottom
MIN0  50,90.64 180 top
MIN1  54.25,90.42 174 top
MIN2  58.45,89.75 168 top
MIN3  62.56,88.65 162 top
MIN4  66.53,87.13 156 top
MIN5  70.32,85.2 150 top
MIN6  73.89,82.88 144 top
MIN7  77.19,80.2 138 top
MIN8  80.2,77.19 132 top
MIN9  82.88,73.89 126 top
MIN10  85.2,70.32 120 top
MIN11  87.13,66.53 114 top
MIN12  88.65,62.56 108 top
MIN13  89.75,58.45 102 top
MIN14  90.42,54.25 96 top
MIN15  90.64,50 90 top
MIN16  90.42,45.75 84 top
MIN17  89.75,41.55 78 top
MIN18  88.65,37.44 72 top
MIN19  87.13,33.47 66 top
MIN20  85.2,29.68 60 top
MIN21  82.88,26.11 54 top
MIN22  80.2,22.81 48 top
MIN23  77.19,19.8 42 top
MIN24  73.89,17.12 36 top
MIN25  70.32,14.8 30 top
MIN26  66.53,12.87 24 top
MIN27  62.56,11.35 18 top
MIN28  58.45,10.25 12 top
MIN29  54.25,9.58 6 top
MIN30  50,9.36 0 top
MIN31  45.75,9.58 354 top
MIN32  41.55,10.25 348 top
MIN33  37.44,11.35 342 top
MIN34  33.47,12.87 336 top
MIN35  29.68,14.8 330 top
MIN36  26.11,17.12 324 top
MIN37  22.81,19.8 318 top
MIN38  19.8,22.81 312 top
MIN39  17.12,26.11 306 top
MIN40  14.8,29.68 300 top
MIN41  12.87,33.47 294 top
MIN42  11.35,37.44 288 top
MIN43  10.25,41.55 282 top
MIN44  9.58,45.75 276 top
MIN45  9.36,50 270 top
MIN46  9.58,54.25 264 top
MIN47  10.25,58.45 258 top
MIN48  11.35,62.56 252 top
MIN49  12.87,66.53 246 top
MIN50  14.8,70.32 240 top
MIN51  17.12,73.89 234 top
MIN52  19.8,77.19 228 top
MIN53  22.81,80.2 222 top
MIN54  26.11,82.88 216 top
MIN55  29.68,85.2 210 top
MIN56  33.47,87.13 204 top
MIN57  37.44,88.65 198 top
MIN58  41.55,89.75 192 top
MIN59  45.75,90.42 186 top
SEC0  50,95.72 0 top
SEC1  54.78,95.47 354 top
SEC2  59.51,94.72 348 top
SEC3  64.13,93.48 342 top
SEC4  68.6,91.77 336 top
SEC5  72.86,89.59 330 top
SEC6  76.87,86.99 324 top
SEC7  80.59,83.98 318 top
SEC8  83.98,80.59 312 top
SEC9  86.99,76.87 306 top
SEC10  89.59,72.86 300 top
SEC11  91.77,68.6 294 top
SEC12  93.48,64.13 288 top
SEC13  94.72,59.51 282 top
SEC14  95.47,54.78 276 top
SEC15  95.72,50 270 top
SEC16  95.47,45.22 264 top
SEC17  94.72,40.49 258 top
SEC18  93.48,35.87 252 top
SEC19  91.77,31.4 246 top
SEC20  89.59,27.14 240 top
SEC21  86.99,23.13 234 top
SEC22  83.98,19.41 228 top
SEC23  80.59,16.02 222 top
SEC24  76.87,13.01 216 top
SEC25  72.86,10.41 210 top
SEC26  68.6,8.23 204 top
SEC27  64.13,6.52 198 top
SEC28  59.51,5.28 192 top
SEC29  54.78,4.53 186 top
SEC30  50,4.28 180 top
SEC31  45.22,4.53 174 top
SEC32  40.49,5.28 168 top
SEC33  35.87,6.52 162 top
SEC34  31.4,8.23 156 top
SEC35  27.14,10.41 150 top
SEC36  23.13,13.01 144 top
SEC37  19.41,16.02 138 top
SEC38  16.02,19.41 132 top
SEC39  13.01,23.13 126 top
SEC40  10.41,27.14 120 top
SEC41  8.23,31.4 114 top
SEC42  6.52,35.87 108 top
SEC43  5.28,40.49 102 top
SEC44  4.53,45.22 96 top
SEC45  4.28,50 90 top
SEC46  4.53,54.78 84 top
SEC47  5.28,59.51 78 top
SEC48  6.52,64.13 72 top
SEC49  8.23,68.6 66 top
SEC50  10.41,72.86 60 top
SEC51  13.01,76.87 54 top
SEC52  16.02,80.59 48 top
SEC53  19.41,83.98 42 top
SEC54  23.13,86.99 36 top
SEC55  27.14,89.59 30 top
SEC56  31.4,91.77 24 top
SEC57  35.87,93.48 18 top
SEC58  40.49,94.72 12 top
SEC59  45.22,95.47 6 top
TOUCH  50,55 0 bottom
U$1  [TIMEARC_KEEPOUT]  0,0 0 top
U$2  50,50 0 top
U$3  [TIMEARC_LOGO_SIMPLE]  50,49.75 0 top

### Tracks (layer width: path | path; a pad name or v marks a point on that pad's centre or on a via)
5V  (via drill 0.31)
  Top 0.203: 49.5,93 v50,93 | 63,91.5 v63.5,91 | 75,85.5 v75.5,85 | 84.5,76 v85,75.5 | 90.5,64 v91,63.5 | 93,50.5 v93,50 | 91,37 v91,36.5 | 85,25 v85,24.5 | 76,15.5 v75.5,15 | 64,9.5 v63.5,9 | 50.5,7 v50,7 | 37,9 v36.5,9 | 25,14.5 v24.5,15 | 15.5,24 v15,24.5 | 9.5,36 v9,36.5 | 7,49.5 v7,50 | 9,63 v9,63.5 | 14.5,75 v15,75.5 | 24,84.5 v24.5,85 | 36,90.5 v36.5,91 | 51.5,83 v52,83 | 62,81.5 v62.5,81 | 71,76 v71.5,75.5 | 81.5,58.5 v82,58 | 83,48 v83,47.5 | 81.5,38 v81,37.5 | 76,29 v75.5,28.5 | 68,22.5 v67.5,22 | 58.5,18.5 v58,18 | 48,17 v47.5,17 | 38,19 v37.5,19.5 | 29.5,24 v29,24.5 | 22.5,32 v22,32.5 | 18.5,41.5 v18,42 | 17,52 v17,52.5 | 18.5,61.5 v19,62 | 24,71 v24.5,71.5 | 32,77.5 v32.5,78 | 41.5,81.5 v42,82
  Bottom 0.203: ICH1.8 48.09,92.59 48.5,93 v50,93 51,93 52,94 53.47,94 ICH1.+5V | ICH2.8 60.61,90.11 62,91.5 63,91.5 v63.5,91 66.73,91 ICH2.+5V | ICH5.8 72.15,83.65 74,85.5 75,85.5 v75.5,85 76,85 77.5,83.5 78.65,83.5 ICH5.+5V | ICH6.8 81.67,75.17 83,76.5 84,76.5 v85,75.5 86.5,74 86.73,74 ICH6.+5V | ICH9.8 90.26,64.24 v91,63.5 92.5,62 92.5,60.73 ICH9.+5V | ICH10.8 92.59,51.91 93,51.5 v93,50 93,47.53 ICH10.+5V | ICH13.8 89.11,39.39 91,37.5 v91,36.5 91,33.27 ICH13.+5V | ICH14.8 83.65,27.85 85,26.5 v85,24.5 85,22.72 ICH14.+5V | ICH17.8 75.17,18.33 76.5,17 76.5,16 v75.5,15 75.5,14.77 ICH17.+5V | ICH18.8 64.24,11.76 65,11 65,9.5 64,9.5 v63.5,9 63,9 62,8 61.23,8 ICH18.+5V | ICH21.8 51.91,7.41 51.5,7 v50,7 49.5,7 48.5,6 46.53,6 ICH21.+5V | ICH22.8 39.39,9.89 38.5,9 v36.5,9 33.27,9 ICH22.+5V | ICH25.8 27.91,15.91 26.5,14.5 25,14.5 v24.5,15 22.72,15 ICH25.+5V | ICH26.8 18.33,24.83 17,23.5 16,23.5 v15,24.5 14.77,24.5 ICH26.+5V | ICH29.8 11.76,35.76 11.5,35.5 9.5,35.5 9.5,36 v9,36.5 7.5,38 7.5,39.27 ICH29.+5V | ICH30.8 7.41,48.09 7,48.5 v7,50 7,51 6,52 6,53.47 ICH30.+5V | ICH33.8 9.89,60.61 9,61.5 v9,63.5 9,66.73 ICH33.+5V | ICH34.8 16.35,72.15 14.5,74 14.5,75 v15,75.5 16.5,77 16.5,78.65 ICH34.+5V | ICH37.8 24.83,81.67 23.5,83 23.5,84 v24.5,85 24.5,85.23 ICH37.+5V | ICH41.8 35.76,90.26 v36.5,91 37,91 39,93 39.68,93 ICH41.+5V | ICL3.8 48.09,82.59 48.5,83 v52,83 52.63,83 ICL3.+5V | ICL4.8 57.47,80.47 59,82 61.5,82 v62.5,81 63.66,81 ICL4.+5V | ICL7.8 66.12,75.62 68,77.5 69.5,77.5 v71.5,75.5 72.58,75.5 ICL7.+5V | ICL8.8 73.2,69.2 74,70 76,70 v78,67.5 79.03,67.5 ICL8.+5V | ICL11.8 80.9,61.1 81.5,60.5 v82,58 82.43,58 ICL11.+5V
  Bottom 0.203: ICL12.8 82.09,51.91 83,51 v83,47.5 83,47.37 ICL12.+5V | ICL15.8 80.47,42.53 81.5,41.5 81.5,38 v81,37.5 81,36.34 ICL15.+5V | ICL16.8 75.62,33.88 77,32.5 77,30 v75.5,28.5 75.5,27.42 ICL16.+5V | ICL19.8 69.2,26.8 70.5,25.5 70.5,24 70,23.5 69,23.5 v67.5,22 67.5,20.96 ICL19.+5V | ICL20.8 61.1,19.6 60.5,19 59,19 v58,18 58,17.57 ICL20.+5V | ICL23.8 51.91,17.91 51,17 v47.5,17 47.37,17 ICL23.+5V | ICL24.8 42.53,19.53 41.5,18.5 38.5,18.5 v37.5,19.5 37,19 36.34,19 ICL24.+5V | ICL27.8 33.88,24.38 32.5,23 30.5,23 v29,24.5 27.42,24.5 ICL27.+5V | ICL28.8 26.8,30.8 25.5,29.5 25,29.5 v22,32.5 20.96,32.5 ICL28.+5V | ICL31.8 21.4,38.9 20.5,38 20,38 18.5,39.5 18.5,41.5 v18,42 17.5,42.5 17.07,42.5 ICL31.+5V | ICL32.8 17.91,48.09 17,49 v17,52.5 17,52.63 ICL32.+5V | ICL35.8 19.53,57.47 18.5,58.5 18.5,61.5 v19,62 19,63.66 ICL35.+5V | ICL36.8 24.38,66.12 23,67.5 23,70 v24.5,71.5 24.5,72.58 ICL36.+5V | ICL39.8 30.8,73.2 29,75 29,75.5 29.5,76 30.5,76 v32.5,78 32.5,79.03 ICL39.+5V | ICL43.8 38.9,80.9 39.5,81.5 41.5,81.5 v42,82 42,82.43 ICL43.+5V | ICC1.8 48.09,72.59 49,73.5 53.29,73.5 ICC1.+5V v53.5,75.5 | v53.5,75.5 | ICC2.8 71.59,51.91 73.5,50 73.5,46.71 ICC2.+5V v76,46.5 | v76,46.5 | ICC3.8 51.91,26.91 51,26 46.79,26 ICC3.+5V v46.5,24 | v46.5,24 | ICC4.8 26.91,48.09 26,49 26,53.21 ICC4.+5V v24.5,53.5 | v24.5,53.5
  Bottom 0.61: +5V1.1 v29.5,67 v29.5,66 v29.5,68 | +5V.1 v70.5,67 v70.5,66 v70.5,68
  pour Top (isolate 0.305): 0,100 100,100 100,0 0,0
GND  (via drill 0.31)
  Top 0.203: v8.5,57 v11,56.5 | v13,69 v15.5,67.5 | v21.5,79 v23.5,77 | v32,86 v33.5,83.5 | v44,90 v44,87.5 | v56.5,91.5 v56.5,89 | v69,87 v68,84.5 | v79,79 v77,77 | v86,68 v84,67 | v89.5,56 v86.5,56 | v90.5,43.5 v88,43.5 | v84,32.5 v86.5,31 | v77,22.5 v79,20.5 | v66.5,16.5 v68,14 | v55.5,12.5 v56,10 | v43.5,11 v43,8.5 | v32.5,15.5 v31,13.5 | v23.5,23.5 v21.5,21.5 | v13,31.5 v15.5,33 | v10,44 v13,45
  pour Bottom (isolate 0.305): 0,100 100,100 100,0 0,0
N$1  (via drill 0.31)
  Top 0.203: SEC59.C 45.13,97.87 v45,98
  Bottom 0.203: v45,98 47,98 48,97 48,96.25 ICH1.1
N$2  (via drill 0.31)
  Top 0.203: SEC1.C 54.87,97.87 v55,98
  Bottom 0.203: v55,98 51.48,98 51.48,97.98 50.5,97 50.5,96.5 ICH1.3
N$3  (via drill 0.31)
  Top 0.203: SEC0.C v50,98 | v50,98
  Bottom 0.203: v50,98 49.5,97.5 49.5,96.29 ICH1.2
N$4  (via drill 0.31)
  Top 0.203: SEC2.C 59.68,97.18 v60,97.5
  Bottom 0.203: v60,97.5 61.5,97.5 63,96 63,95.03 ICH2.1
N$5  (via drill 0.31)
  Top 0.203: SEC3.C 64.39,95.39 v65,96
  Bottom 0.203: v65,96 64,95 64,94.43 ICH2.2
N$6  (via drill 0.31)
  Top 0.203: SEC4.C 68.94,93.44 v69.5,94
  Bottom 0.203: v69.5,94 68.5,95 65.5,95 65,94.5 65,93.83 ICH2.3
N$7  (via drill 0.31)
  Top 0.203: SEC5.C 73.33,90.33 v74.5,91.5
  Bottom 0.203: v74.5,91.5 74.5,89.55 ICH5.1
N$8  (via drill 0.31)
  Top 0.203: SEC6.C 77.37,87.87 v79,89.5
  Bottom 0.203: v79,89.5 78.4,89.5 ICH5.2
N$9  (via drill 0.31)
  Top 0.203: SEC7.C 81.16,84.66 v82.5,86
  Bottom 0.203: v82.5,86 80.5,88 78.68,88 ICH5.3
N$10  (via drill 0.31)
  Top 0.203: SEC8.C 84.66,81.16 v86,82.5
  Bottom 0.203: v86,82.5 86,78.89 ICH6.1
N$11  (via drill 0.31)
  Top 0.203: SEC9.C 88.37,77.37 v89.5,78.5
  Bottom 0.203: v89.5,78.5 87.82,78.5 ICH6.2
N$12  (via drill 0.31)
  Top 0.203: SEC10.C 90.78,73.28 v92,74.5
  Bottom 0.203: v92,74.5 92,75.5 90,77.5 88.6,77.5 ICH6.3
N$13  (via drill 0.31)
  Top 0.203: SEC17.C 97.18,40.32 v97.5,40
  Bottom 0.203: v97.5,40 96.93,40 ICH13.1
N$14  (via drill 0.31)
  Top 0.203: SEC11.C 93.44,68.94 v94,69.5
  Bottom 0.203: v94,69.5 94,66.77 ICH9.1
N$15  (via drill 0.31)
  Top 0.203: SEC12.C 95.39,64.39 v96,65
  Bottom 0.203: v96,65 95.5,65.5 94.33,65.5 ICH9.2
N$16  (via drill 0.31)
  Top 0.203: SEC13.C 97.18,59.68 v97.5,60
  Bottom 0.203: v97.5,60 97.5,62.5 96,64 94.43,64 ICH9.3
N$17  (via drill 0.31)
  Top 0.203: SEC39.C 11.63,22.63 v10.5,21.5
  Bottom 0.203: v10.5,21.5 12.18,21.5 ICH26.2
N$18  (via drill 0.31)
  Top 0.203: SEC14.C 97.87,54.87 v98,55
  Bottom 0.203: v98,55 98,53.75 ICH10.1
N$19  (via drill 0.31)
  Top 0.203: SEC15.C v98,50 | v98,50
  Bottom 0.203: v98,50 98,50.5 96.29,50.5 ICH10.2
N$20  (via drill 0.31)
  Top 0.203: SEC16.C 97.87,45.13 v98,45
  Bottom 0.203: v98,45 98,48.5 97,49.5 96.29,49.5 ICH10.3
N$21  (via drill 0.31)
  Top 0.203: SEC20.C 90.78,26.71 v92,25.5
  Bottom 0.203: v92,25.5 89.55,25.5 ICH14.1
N$22  (via drill 0.31)
  Top 0.203: SEC18.C 95.89,35.61 v96.5,35
  Bottom 0.203: v96.5,35 96.5,35.5 96,36 94.43,36 ICH13.2
N$23  (via drill 0.31)
  Top 0.203: SEC19.C 93.44,31.06 v94.5,30
  Bottom 0.203: v94.5,30 95,30 96,31 96,33.5 94.5,35 93.83,35 ICH13.3
N$24  (via drill 0.31)
  Top 0.203: SEC21.C 87.87,22.63 v89,21.5
  Bottom 0.203: v89,21.5 89,22 88.6,22.5 ICH14.2
N$25  (via drill 0.31)
  Top 0.203: SEC22.C 84.66,18.84 v86,17.5
  Bottom 0.203: v86,17.5 86.5,17.5 89,20 89,20.5 88,21.5 87.82,21.5 ICH14.3
N$26  (via drill 0.31)
  Top 0.203: SEC40.C 9.21,26.71 v8,25.5
  Bottom 0.203: v8,25.5 8,24 9.5,22.5 11.4,22.5 ICH26.3
N$27  (via drill 0.31)
  Top 0.203: SEC23.C 81.16,15.34 v82.5,14
  Bottom 0.203: v82.5,14 78.89,14 ICH17.1
N$28  (via drill 0.31)
  Top 0.203: SEC24.C 77.37,12.13 v78.5,11
  Bottom 0.203: v78.5,11 78.5,12.18 ICH17.2
N$29  (via drill 0.31)
  Top 0.203: SEC25.C 73.28,9.21 v74.5,8
  Bottom 0.203: v74.5,8 76,8 77.5,9.5 77.5,11.4 ICH17.3
N$30  (via drill 0.31)
  Top 0.203: SEC26.C 68.94,6.56 v70,5.5
  Bottom 0.203: v70,5.5 67.27,5.5 ICH18.1
N$31  (via drill 0.31)
  Top 0.203: SEC27.C 64.39,4.11 v65,3.5
  Bottom 0.203: v65,3.5 65.5,4 65.5,5.67 ICH18.2
N$32  (via drill 0.31)
  Top 0.203: SEC28.C 59.68,2.82 v60,2.5
  Bottom 0.203: v60,2.5 62.5,2.5 64,4 64,5.57 ICH18.3
N$33
  Bottom 0.203: ICH29.5 11.39,39.39 12,40 12,44 11,45 11,50 10.5,50.5 9.93,50.5 ICH30.6
N$34  (via drill 0.31)
  Top 0.203: SEC41.C 6.56,31.06 v5.5,30
  Bottom 0.203: v5.5,30 5.5,31.5 7,33 7,33.62 ICH29.1
N$35  (via drill 0.31)
  Top 0.203: SEC29.C 54.87,2.13 v55,2
  Bottom 0.203: v55,2 53.75,2 ICH21.1
N$36  (via drill 0.31)
  Top 0.203: SEC30.C v50,2 | v50,2
  Bottom 0.203: v50,2 50.5,2.5 50.5,3.71 ICH21.2
N$37  (via drill 0.31)
  Top 0.203: SEC31.C 45.13,3.63 45,3.5 v45,2
  Bottom 0.203: v45,2 48.5,2 49.5,3 49.5,3.71 ICH21.3
N$38  (via drill 0.31)
  Top 0.203: SEC42.C 4.61,35.61 v4,35
  Bottom 0.203: v4,35 4.5,34.5 5.67,34.5 ICH29.2
N$39  (via drill 0.31)
  Top 0.203: SEC32.C 40.32,3.32 v40,3
  Bottom 0.203: v40,3 40,3.07 ICH22.1
N$40  (via drill 0.31)
  Top 0.203: SEC33.C 35.61,4.61 v35,4
  Bottom 0.203: v35,4 36,5 36,5.57 ICH22.2
N$41  (via drill 0.31)
  Top 0.203: SEC34.C 31.06,7.06 v30,6
  Bottom 0.203: v30,6 32,4 34,4 35,5 35,6.17 ICH22.3
N$42  (via drill 0.31)
  Top 0.203: SEC43.C 2.82,40.32 v2.5,40
  Bottom 0.203: v2.5,40 2.5,37 3.5,36 5.57,36 ICH29.3
N$43  (via drill 0.31)
  Top 0.203: SEC35.C 26.71,9.21 v26,8.5
  Bottom 0.203: v26,8.5 25.5,8.5 24,10 24,11.13 ICH25.1
N$44  (via drill 0.31)
  Top 0.203: SEC36.C 22.63,12.13 v21.5,11
  Bottom 0.203: v21.5,11 22.5,11 23,11.5 23,11.9 ICH25.2
N$45  (via drill 0.31)
  Top 0.203: SEC37.C 18.84,15.34 v17.5,14
  Bottom 0.203: v17.5,14 17.5,13 19.5,11 20.32,11 ICH25.3
N$46
  Bottom 0.203: ICH30.5 9.79,56.79 13,60 13,62.5 12.5,63 11.99,63 ICH33.6
N$47  (via drill 0.31)
  Top 0.203: SEC38.C 15.34,18.84 v14,17.5
  Bottom 0.203: v14,17.5 14,21.11 ICH26.1
N$48  (via drill 0.31)
  Top 0.203: SEC44.C 2.13,45.13 v2,45
  Bottom 0.203: v2,45 2,46.25 ICH30.1
N$49  (via drill 0.31)
  Top 0.203: SEC45.C v2,50 | v2,50
  Bottom 0.203: v2,50 2.5,49.5 3.71,49.5 ICH30.2
N$50  (via drill 0.31)
  Top 0.203: SEC46.C 2.13,54.87 v2,55
  Bottom 0.203: v2,55 2,51.5 3,50.5 3.71,50.5 ICH30.3
N$51
  Bottom 0.203: ICH33.5 12.35,66.35 16.5,70.5 17,70.5 19,72.5 19,73 18.49,73.5 ICH34.6
N$52  (via drill 0.31)
  Top 0.203: SEC47.C 2.82,59.68 v2.5,60
  Bottom 0.203: v2.5,60 2.5,61 4,62.5 5.47,62.5 ICH33.1
N$53  (via drill 0.31)
  Top 0.203: SEC48.C 4.61,64.39 v4,65
  Bottom 0.203: v4,65 4,64.5 4.5,64 5.57,64 ICH33.2
N$54  (via drill 0.31)
  Top 0.203: SEC49.C 7.06,68.94 v6,70
  Bottom 0.203: v6,70 4,68 4,66.5 5.5,65 6.17,65 ICH33.3
N$55
  Bottom 0.203: ICH34.5 19.67,75.17 24,79.5 25,79.5 27.5,82 27.5,82.28 ICH37.6
N$56  (via drill 0.31)
  Top 0.203: SEC50.C 9.21,73.28 v8,74.5
  Bottom 0.203: v8,74.5 9.5,76 11.13,76 ICH34.1
N$57  (via drill 0.31)
  Top 0.203: SEC51.C 12.13,77.37 v11,78.5
  Bottom 0.203: v11,78.5 11,77.5 11.5,77 11.9,77 ICH34.2
N$58  (via drill 0.31)
  Top 0.203: SEC52.C 15.34,81.16 v14,82.5
  Bottom 0.203: v14,82.5 14,82 12,80 12,78.68 ICH34.3
N$59
  Bottom 0.203: ICH37.5 31.15,83.65 32.5,85 33,85 34,86 37.5,86 38.5,87 38.5,88.11 ICH41.6
N$60  (via drill 0.31)
  Top 0.203: SEC53.C 18.84,84.66 v17.5,86
  Bottom 0.203: v17.5,86 19,87.5 20.5,87.5 21,87 21,86.55 ICH37.1
N$61  (via drill 0.31)
  Top 0.203: SEC54.C 22.63,87.87 v21.5,89
  Bottom 0.203: v21.5,89 21.5,87.82 ICH37.2
N$62  (via drill 0.31)
  Top 0.203: SEC55.C 26.71,90.78 v25.5,92
  Bottom 0.203: v25.5,92 25,92 22.5,89.5 22.5,88.6 ICH37.3
N$63
  Bottom 0.203: ICH41.5 44.67,88.83 45,88.5 45,86.5 47,85 47,79 47.5,78.5 49.5,78.5 50.5,79.5 50.5,79.91 ICL3.6
N$64  (via drill 0.31)
  Top 0.203: SEC56.C 31.06,93.44 v30,94.5
  Bottom 0.203: v30,94.5 32.73,94.5 ICH41.1
N$65  (via drill 0.31)
  Top 0.203: SEC57.C 35.61,95.39 v35,96
  Bottom 0.203: v35,96 34.5,95.5 34.5,94.33 ICH41.2
N$66  (via drill 0.31)
  Top 0.203: SEC58.C 40.32,97.18 v40,97.5
  Bottom 0.203: v40,97.5 38,97.5 36,95.5 36,94.43 ICH41.3
N$67
  Bottom 0.203: ICH1.5 57.29,90.21 60.5,87 62.5,87 63,87.5 63,88.01 ICH2.6
N$68
  Bottom 0.203: ICH2.5 66.35,87.65 72.5,81.5 73.5,81.5 73.5,81.51 ICH5.6
N$69
  Bottom 0.203: ICH5.5 75.17,80.83 80,76 80,73.5 81.5,72 82,72 82.5,72.5 82.5,72.72 ICH6.6
N$70
  Bottom 0.203: ICH6.5 83.65,68.85 85.5,67 85.5,63.5 87.5,61.5 88.11,61.5 ICH9.6
N$71
  Bottom 0.203: ICH9.5 88.61,60.61 88,60 88,55 89,54 89,50 89.5,49.5 90.07,49.5 ICH10.6
N$72
  Bottom 0.203: ICH10.5 90.21,44.21 88,42 88,41.5 87,40.5 87,37.5 87.5,37 88.01,37 ICH13.6
N$73
  Bottom 0.203: ICH13.5 87.65,34.15 83,29.5 83,29 81.5,27.5 81.5,26.5 81.51,26.5 ICH14.6
N$74
  Bottom 0.203: ICH14.5 80.83,24.83 76,20 74.5,20 73,18.5 73,17.22 ICH17.6
N$75
  Bottom 0.203: ICH17.5 69.85,16.35 69,15.5 67.5,15.5 66,14 63,14 61.5,12.5 61.5,11.88 ICH18.6
N$76
  Bottom 0.203: ICH18.5 50.17,11.17 49.5,10.5 49.5,9.93 ICH21.6
N$77
  Bottom 0.203: ICH21.5 43.71,9.79 41,12.5 39,12.5 38.5,13 37.5,13 37,12.5 37,11.99 ICH22.6
N$78
  Bottom 0.203: ICH22.5 34.15,12.35 28.5,18 27.5,18 27,18.5 26.5,18.5 26.5,18.49 ICH25.6
N$79
  Bottom 0.203: ICH25.5 24.83,20.17 20.5,24.5 20.5,25 18,27.5 17.72,27.5 ICH26.6
N$80
  Bottom 0.203: ICH26.5 16.35,30.15 13.5,33 13.5,35.5 14,36 14,37 12.5,38.5 11.89,38.5 ICH29.6
N$81  (via drill 0.31)
  Top 0.203: MIN59.C 45.84,88.16 v46,88
  Bottom 0.203: v46,88 46.09,88 ICL3.1
N$82  (via drill 0.31)
  Top 0.203: MIN0.C v50,88 | v50,88
  Bottom 0.203: v50,88 49.5,87.5 49.5,86.36 ICL3.2
N$83  (via drill 0.31)
  Top 0.203: MIN1.C 54.16,88.16 v54,88
  Bottom 0.203: v54,88 51.5,88 51,87.5 51,86.36 ICL3.3
N$84  (via drill 0.31)
  Top 0.203: MIN2.C 58.27,87.77 v58,87.5
  Bottom 0.203: v58,87.5 58,86.13 ICL4.1
N$85  (via drill 0.31)
  Top 0.203: MIN3.C 62.3,86.8 v61.5,86
  Bottom 0.203: v61.5,86 61,85.5 61,84.91 ICL4.2
N$86  (via drill 0.31)
  Top 0.203: MIN4.C 66.18,85.68 v65.5,85
  Bottom 0.203: v65.5,85 62,85 62,84.31 ICL4.3
N$87  (via drill 0.31)
  Top 0.203: MIN5.C 69.89,83.89 v69,83
  Bottom 0.203: v69,83 69,80.85 ICL7.1
N$88  (via drill 0.31)
  Top 0.203: MIN6.C 73.19,82.19 v72,81
  Bottom 0.203: v72,81 72,80.85 ICL7.2
N$89  (via drill 0.31)
  Top 0.203: MIN7.C 76.57,79.57 v75.5,78.5
  Bottom 0.203: v75.5,78.5 75,78.5 73.5,80 72.5,80 72,79.5 72,79.08 ICL7.3
N$90  (via drill 0.31)
  Top 0.203: MIN8.C 79.12,76.62 v78,75.5
  Bottom 0.203: v78,75.5 ICL8.1
N$91  (via drill 0.31)
  Top 0.203: MIN9.C 81.89,73.39 v80.5,72
  Bottom 0.203: v80.5,72 79.08,72 ICL8.2
N$92  (via drill 0.31)
  Top 0.203: MIN10.C 83.89,69.89 v83,69
  Bottom 0.203: v83,69 81,71 79.85,71 ICL8.3
N$93  (via drill 0.31)
  Top 0.203: v54.45,80.05 v57.5,77
  Bottom 0.203: ICL3.5 v54.45,80.05 | v57.5,77 59.5,77 60,77.5 60,78.27 ICL4.6
N$94
  Bottom 0.203: ICL4.5 61.51,77.99 66.5,73 67.24,73 ICL7.6
N$95  (via drill 0.31)
  Top 0.203: MIN11.C 85.18,66.18 v84.5,65.5
  Bottom 0.203: v84.5,65.5 84.5,63.79 ICL11.1
N$96  (via drill 0.31)
  Top 0.203: MIN12.C 87.3,62.3 v86.5,61.5
  Bottom 0.203: v86.5,61.5 85.5,61.5 85,62 84.31,62 ICL11.2
N$97  (via drill 0.31)
  Top 0.203: MIN13.C 87.27,58.27 v87,58
  Bottom 0.203: v87,58 87,59.5 85.5,61 84.91,61 ICL11.3
N$98  (via drill 0.31)
  Top 0.203: v69.2,71.8 71.5,69.5 71.5,68 v73.5,66
  Bottom 0.203: ICL7.5 v69.2,71.8 | v73.5,66 74.03,66.5 ICL8.6
N$99  (via drill 0.31)
  Top 0.203: MIN14.C 88.16,54.16 v88,54
  Bottom 0.203: v88,54 88,53.91 ICL12.1
N$100  (via drill 0.31)
  Top 0.203: MIN15.C v88,50 | v88,50
  Bottom 0.203: v88,50 87.5,50.5 86.13,50.5 ICL12.2
N$101  (via drill 0.31)
  Top 0.203: MIN16.C 88.16,45.84 v88,46
  Bottom 0.203: v88,46 88,48.5 87,49.5 86.13,49.5 ICL12.3
N$102
  Bottom 0.203: ICL8.5 75.43,60.57 77.5,58.5 78.59,58.5 ICL11.6
N$103  (via drill 0.31)
  Top 0.203: MIN17.C 87.27,41.73 v87,42
  Bottom 0.203: v87,42 86.13,42 ICL15.1
N$104  (via drill 0.31)
  Top 0.203: MIN18.C 86.8,37.7 v86,38.5
  Bottom 0.203: v86,38.5 85.5,39 84.91,39 ICL15.2
N$105  (via drill 0.31)
  Top 0.203: MIN19.C 85.68,33.82 v85,34.5
  Bottom 0.203: v85,34.5 86,35.5 86,37 85,38 84.31,38 ICL15.3
N$106  (via drill 0.31)
  Top 0.203: v78.5,56 v78.5,51
  Bottom 0.203: ICL11.5 78.97,57.47 v78.5,56 | v78.5,51 78.5,50.5 79.5,49.5 79.91,49.5 ICL12.6
N$107  (via drill 0.31)
  Top 0.203: MIN20.C 83.89,30.11 v83,31
  Bottom 0.203: v83,31 82,30 80.62,30 ICL16.1
N$108  (via drill 0.31)
  Top 0.203: MIN21.C 82.19,26.81 v81,28
  Bottom 0.203: v81,28 80.85,28 ICL16.2
N$109  (via drill 0.31)
  Top 0.203: MIN22.C 79.57,23.43 v78.5,24.5
  Bottom 0.203: v78.5,24.5 80,26.5 80,27.5 79.5,28 79.08,28 ICL16.3
N$110
  Bottom 0.203: ICL12.5 80.05,46.05 76.5,42.5 76.5,41 77,40.5 77.99,40.5 ICL15.6
N$111  (via drill 0.31)
  Top 0.203: MIN23.C 76.57,20.43 v75,22
  Bottom 0.203: v75,22 ICL19.1
N$112  (via drill 0.31)
  Top 0.203: MIN24.C 73.39,18.11 v72.5,19
  Bottom 0.203: v72.5,19 72.5,20.42 ICL19.2
N$113  (via drill 0.31)
  Top 0.203: MIN25.C 69.89,16.11 v69,17
  Bottom 0.203: v69,17 69.5,17 71.5,19 71.5,19.65 ICL19.3
N$114  (via drill 0.31)
  Top 0.203: v76.5,37.5 v72.5,33
  Bottom 0.203: ICL15.5 77.99,38.49 v76.5,37.5 | v72.5,33 73.5,32 73.76,32 ICL16.6
N$115  (via drill 0.31)
  Top 0.203: MIN26.C 66.18,14.32 v65.5,15
  Bottom 0.203: v65.5,15 64.29,15 ICL20.1
N$116  (via drill 0.31)
  Top 0.203: MIN27.C 62.3,13.2 v61.5,14
  Bottom 0.203: v61.5,14 62,14.5 62,15.69 ICL20.2
N$117  (via drill 0.31)
  Top 0.203: MIN28.C 58.27,12.73 v58,13
  Bottom 0.203: v58,13 59.5,13 61,14.5 61,15.09 ICL20.3
N$118  (via drill 0.31)
  Top 0.203: v70.3,30.8 v66.5,27
  Bottom 0.203: ICL16.5 v70.3,30.8 | v66.5,27 66.5,25.97 ICL19.6
N$119  (via drill 0.31)
  Top 0.203: MIN29.C 54.16,11.84 v54,12
  Bottom 0.203: v54,12 53.91,12 ICL23.1
N$120  (via drill 0.31)
  Top 0.203: MIN30.C v50,12 | v50,12
  Bottom 0.203: v50,12 50.5,12.5 50.5,13.87 ICL23.2
N$121  (via drill 0.31)
  Top 0.203: MIN31.C 45.84,11.84 v46,12
  Bottom 0.203: v46,12 48.5,12 49.5,13 49.5,13.87 ICL23.3
N$122
  Bottom 0.203: ICL19.5 60,24.5 58.57,23.07 58.5,22 58.5,21.41 ICL20.6
N$123  (via drill 0.31)
  Top 0.203: MIN32.C 41.73,12.73 v42,13
  Bottom 0.203: v42,13 42,13.87 ICL24.1
N$124  (via drill 0.31)
  Top 0.203: MIN33.C 37.7,13.2 v38.5,14
  Bottom 0.203: v38.5,14 39.5,15 39.5,15.55 ICL24.2
N$125  (via drill 0.31)
  Top 0.203: MIN34.C 33.82,14.32 v34.5,15
  Bottom 0.203: v34.5,15 35.5,14.5 37.5,14.5 38,15 38,15.69 ICL24.3
N$126
  Bottom 0.203: ICL20.5 57.47,21.03 56.5,22 52,22 51.5,21.5 50.5,21.5 49.5,20.5 49.5,20.09 ICL23.6
N$127  (via drill 0.31)
  Top 0.203: MIN35.C 30.11,16.11 v31,17
  Bottom 0.203: v31,17 29.5,18.5 29.5,18.88 ICL27.1
N$128  (via drill 0.31)
  Top 0.203: MIN36.C 26.61,18.11 v27.5,19
  Bottom 0.203: v27.5,19 28.35,19 ICL27.2
N$129  (via drill 0.31)
  Top 0.203: MIN37.C 23.43,20.43 v24.5,21.5
  Bottom 0.203: v24.5,21.5 25,21.5 26.5,20 27.5,20 28,20.5 28,20.92 ICL27.3
N$130
  Bottom 0.203: ICL23.5 45.55,19.95 43,22.5 40.99,22.5 ICL24.6
N$131  (via drill 0.31)
  Top 0.203: MIN38.C 20.43,23.43 v21.5,24.5
  Bottom 0.203: v21.5,24.5 21.5,26.8 ICL28.1
N$132  (via drill 0.31)
  Top 0.203: MIN39.C 18.11,26.61 v19,27.5
  Bottom 0.203: v19,27.5 20.42,27.5 ICL28.2
N$133  (via drill 0.31)
  Top 0.203: MIN40.C 16.11,30.11 v17,31
  Bottom 0.203: v17,31 17,30.5 19,28.5 19.65,28.5 ICL28.3
N$134  (via drill 0.31)
  Top 0.203: v37.99,23.51 v33.5,27
  Bottom 0.203: ICL24.5 v37.99,23.51 | v33.5,27 33,27 32.5,26.74 ICL27.6
N$135  (via drill 0.31)
  Top 0.203: MIN41.C 14.32,33.82 v15,34.5
  Bottom 0.203: v15,34.5 15,35.71 ICL31.1
N$136  (via drill 0.31)
  Top 0.203: MIN42.C 12.7,37.7 v13.5,38.5
  Bottom 0.203: v13.5,38.5 14,38.5 14.5,38 15.69,38 ICL31.2
N$137  (via drill 0.31)
  Top 0.203: MIN43.C 12.23,41.73 v13,42
  Bottom 0.203: v13,42 13,40.5 14.5,39 15.09,39 ICL31.3
N$138  (via drill 0.31)
  Top 0.203: v31.5,28.5 v27,33.5
  Bottom 0.203: ICL27.5 30.8,27.3 31.5,28 v31.5,28.5 | v27,33.5 25.97,33.5 ICL28.6
N$139  (via drill 0.31)
  Top 0.203: MIN44.C 11.84,45.84 v12,46
  Bottom 0.203: v12,46 12,46.09 ICL32.1
N$140  (via drill 0.31)
  Top 0.203: MIN45.C v12,50 | v12,50
  Bottom 0.203: v12,50 12.5,49.5 13.87,49.5 ICL32.2
N$141  (via drill 0.31)
  Top 0.203: MIN46.C 11.84,54.16 v12,54
  Bottom 0.203: v12,54 12,51.5 13,50.5 13.87,50.5 ICL32.3
N$142  (via drill 0.31)
  Top 0.203: v25,35.5 v25,39.5
  Bottom 0.203: ICL28.5 24.57,34.93 v25,35.5 | v25,39.5 22.5,42 21.91,42 ICL31.6
N$143  (via drill 0.31)
  Top 0.203: MIN47.C 12.23,58.27 v12.5,58
  Bottom 0.203: v12.5,58 13.87,58 ICL35.1
N$144  (via drill 0.31)
  Top 0.203: MIN48.C 13.2,62.3 v14,61.5
  Bottom 0.203: v14,61.5 15,60.5 15.55,60.5 ICL35.2
N$145  (via drill 0.31)
  Top 0.203: MIN49.C 14.32,66.18 v15,65.5
  Bottom 0.203: v15,65.5 15,62.5 15.69,62 ICL35.3
N$146  (via drill 0.31)
  Top 0.203: v22,44 v22,49
  Bottom 0.203: ICL31.5 20.84,42.84 v22,44 | v22,49 20.5,50.5 20.09,50.5 ICL32.6
N$147  (via drill 0.31)
  Top 0.203: MIN50.C 16.11,69.89 v17,69
  Bottom 0.203: v17,69 19.15,69 ICL36.1
N$148  (via drill 0.31)
  Top 0.203: MIN51.C 18.11,73.39 v19.5,72
  Bottom 0.203: v19.5,72 19.5,71.65 ICL36.2
N$149  (via drill 0.31)
  Top 0.203: MIN52.C 20.43,76.57 v21.5,75.5
  Bottom 0.203: v21.5,75.5 21.5,74 20.5,73 20.5,72.42 ICL36.3
N$150  (via drill 0.31)
  Top 0.203: v19.95,52.95 20,53.5 21.5,55 v21.5,55.5
  Bottom 0.203: ICL32.5 v19.95,52.95 | v21.5,55.5 22,55.5 23.5,57 23.5,59 23,59.5 22.01,59.5 ICL35.6
N$151  (via drill 0.31)
  Top 0.203: MIN53.C 23.43,79.57 v24.5,78.5
  Bottom 0.203: v24.5,78.5 26.8,78.5 ICL39.1
N$152  (via drill 0.31)
  Top 0.203: MIN54.C 26.61,81.89 v27.5,81
  Bottom 0.203: v27.5,81 27.5,79.58 ICL39.2
N$153  (via drill 0.31)
  Top 0.203: MIN55.C 30.11,83.89 v31,83
  Bottom 0.203: v31,83 29,81 29,79.85 ICL39.3
N$154  (via drill 0.31)
  Top 0.203: v24.01,61.01 v27,66.5
  Bottom 0.203: ICL35.5 v24.01,61.01 | v27,66.5 26.5,68 26.24,68 ICL36.6
N$155  (via drill 0.31)
  Top 0.203: MIN56.C 33.82,85.68 v34.5,85
  Bottom 0.203: v34.5,85 35.71,85 ICL43.1
N$156  (via drill 0.31)
  Top 0.203: MIN57.C 38.2,86.8 v38.5,86
  Bottom 0.203: v38.5,86 38,84.31 ICL43.2
N$157  (via drill 0.31)
  Top 0.203: MIN58.C 41.73,87.77 v42,87.5
  Bottom 0.203: v42,87.5 41,87.5 39,85.5 39,84.91 ICL43.3
N$158  (via drill 0.31)
  Top 0.203: v28.7,69.2 30,71 31.5,71 v34,73.5
  Bottom 0.203: ICL36.5 v28.7,69.2 | v34,73.5 34,73.53 ICL39.6
N$159  (via drill 0.31)
  Top 0.203: v35.43,75.43 v42,75.5
  Bottom 0.203: ICL39.5 v35.43,75.43 | v42,75.5 42,78.09 ICL43.6
N$160  (via drill 0.31)
  Top 0.203: v63,72.5 53.5,82.5 53.5,86.5 51.5,88.5 v51.5,92.5
  Bottom 0.203: DIN.1 v63,72.5 | v51.5,92.5 50.5,91.5 50.5,90.34 ICH1.6
N$161  (via drill 0.31)
  Top 0.203: HOUR11.C 35,77 42,77 v43,77.5
  Bottom 0.203: v43,77.5 47.5,77.5 48,77 48,75.93 ICC1.1
N$162  (via drill 0.31)
  Top 0.203: HOUR0.C v50,78 | v50,78
  Bottom 0.203: v50,78 49.5,77.5 49.5,75.97 ICC1.2
N$163  (via drill 0.31)
  Top 0.203: HOUR1.C v63.5,74.5 | v59,74.5 56,77.5 v51.5,77.5
  Bottom 0.203: v63.5,74.5 v59,74.5 | v51.5,77.5 50.5,76.5 50.5,75.97 ICC1.3
N$164
  Bottom 0.203: ICC4.5 30.11,59.61 37,66.5 DOUT.1
N$165  (via drill 0.31)
  Top 0.203: HOUR2.C 76,64.5 v76,53
  Bottom 0.203: v76,53 ICC2.1
N$166  (via drill 0.31)
  Top 0.203: HOUR3.C v78,50
  Bottom 0.203: v78,50 77.5,50.5 76.5,50.5 ICC2.2
N$167  (via drill 0.31)
  Top 0.203: HOUR4.C 78.5,34 78.5,48 v77.5,49
  Bottom 0.203: v77.5,49 77,49.5 75.97,49.5 ICC2.3
N$169  (via drill 0.31)
  Top 0.203: HOUR5.C 65,23.5 64.5,24 v54,24
  Bottom 0.203: v54,24 ICC3.1
N$170  (via drill 0.31)
  Top 0.203: HOUR6.C v50,22
  Bottom 0.203: v50,22 50.5,22.5 ICC3.2
N$171  (via drill 0.31)
  Top 0.203: HOUR7.C 34,22 v49,22
  Bottom 0.203: v49,22 49.5,22.5 49.5,24.03 ICC3.3
N$173  (via drill 0.31)
  Top 0.203: HOUR8.C 20.64,33.15 24,35 v24,46.5
  Bottom 0.203: v24,46.5 24,47.93 ICC4.1
N$174  (via drill 0.31)
  Top 0.203: HOUR9.C v22,50
  Bottom 0.203: v22,50 22.5,49.5 ICC4.2
N$175  (via drill 0.31)
  Top 0.203: HOUR10.C 22.5,65.5 v22.5,51
  Bottom 0.203: v22.5,51 23,50.5 24.03,50.5 ICC4.3
N$176  (via drill 0.31)
  Top 0.203: v44.5,78.5 v44.5,76
  Bottom 0.203: ICL43.5 43.84,79.17 v44.5,78.5 | v44.5,76 44.5,71 47.5,68 50,68 50.5,68.5 50.5,69.75 ICC1.6
N$177
  Bottom 0.203: ICC1.5 51.91,65.59 68,49.5 69.75,49.5 ICC2.6
N$178
  Bottom 0.203: ICC2.5 65.59,48.09 49,31.5 49,30.48 ICC3.6
N$179
  Bottom 0.203: ICC3.5 48.09,34.41 32,50.5 30.25,50.5 ICC4.6
TOUCH
  Bottom 0.203: TOUCH.1 U$2.P$2

### Text on the board
tPlace: XII | I | XI | II | X | III | IX | IV | VIII | V | VII | VI
bPlace: Time Arc, Front / Armin Oonk, APR2016